# EAGLE design Uni-2,0,Complete (EAGLE 9.6.2)

## Sheet 1 of 4
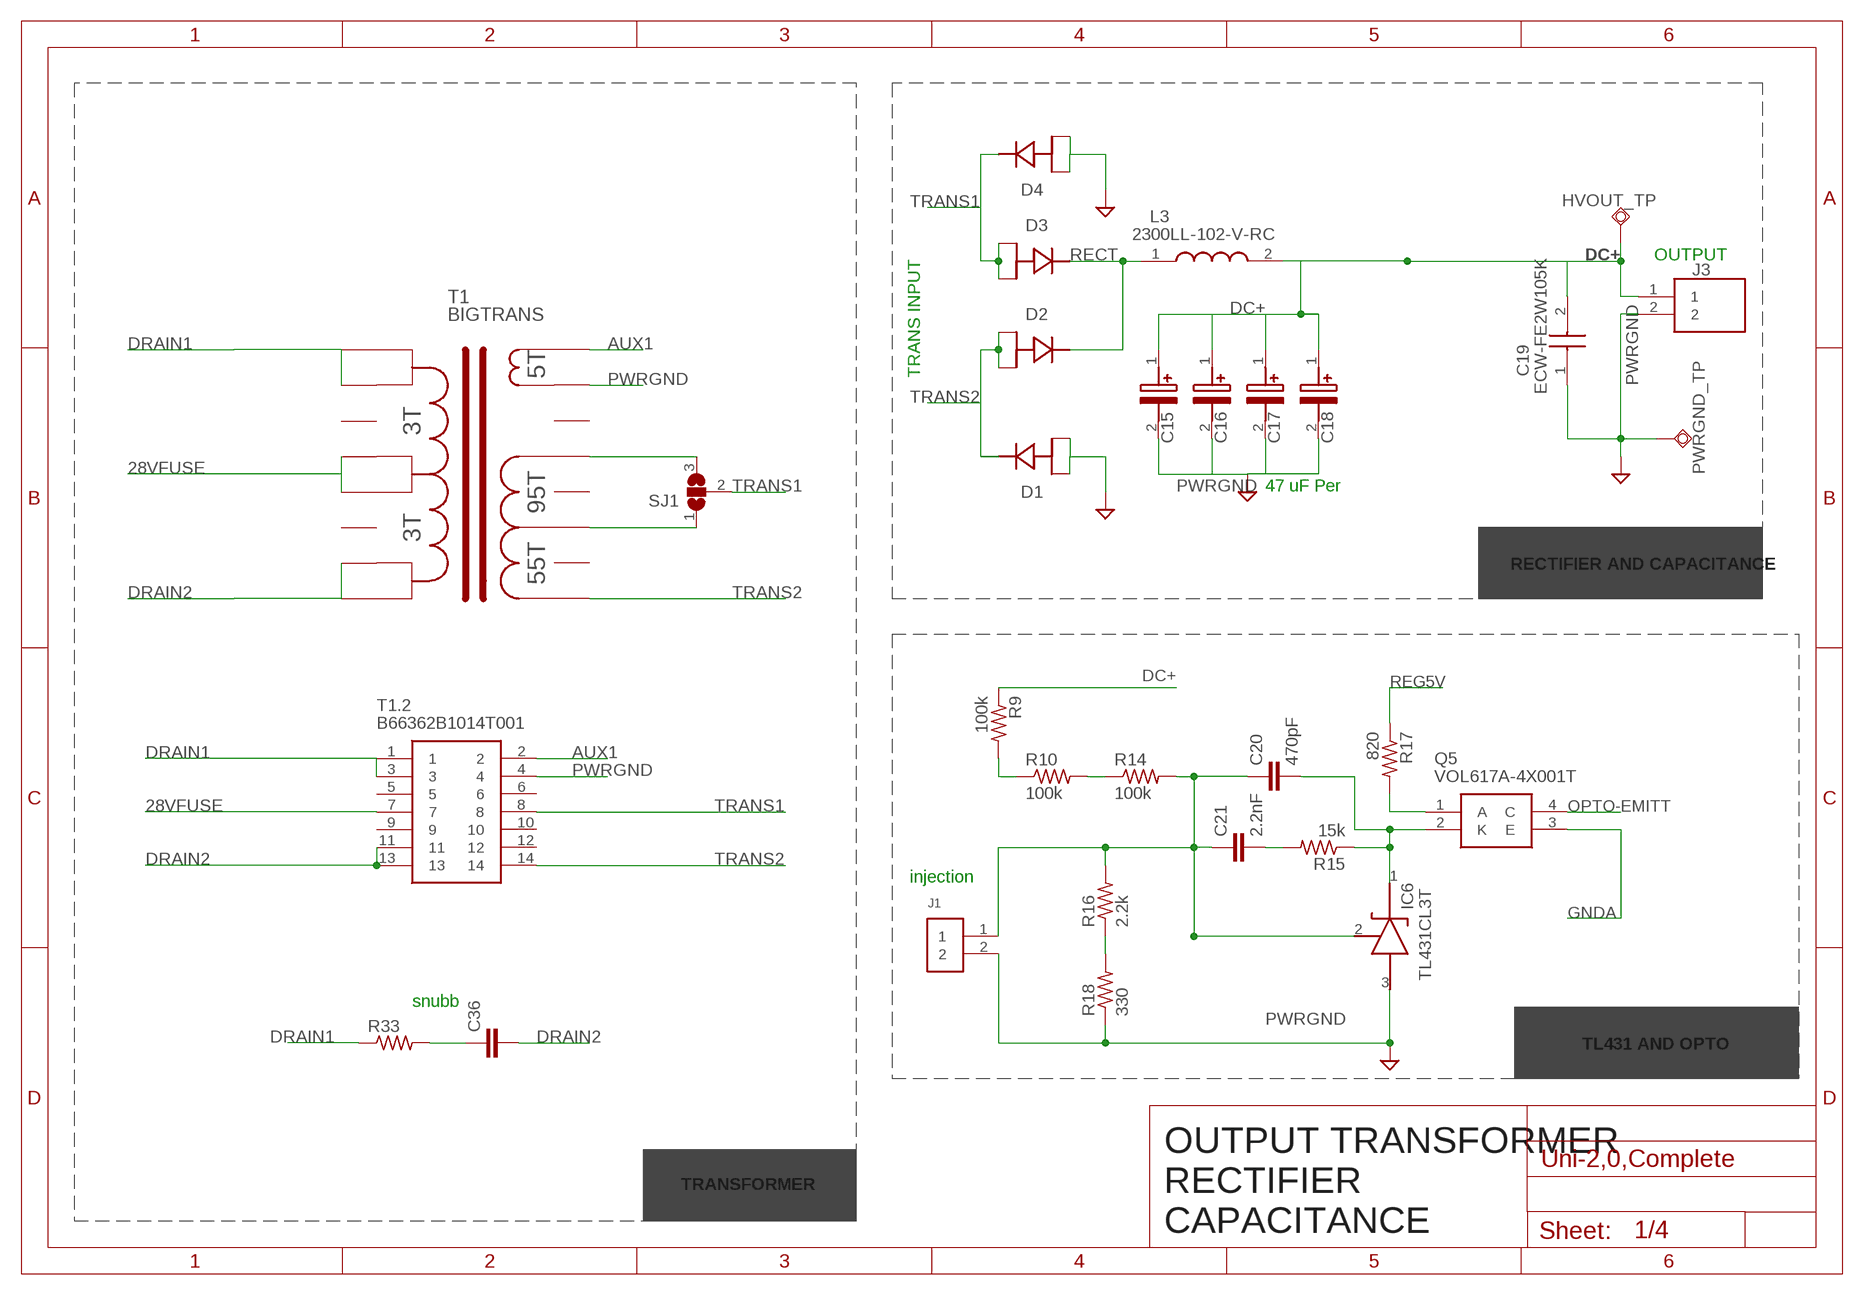
[diagram p0: schematic, sheet 1]

### Parts
C15  EEU-ED2V470S  [CAPPRD750W85D1800H2200]
C16  EEU-ED2V470S  [CAPPRD750W85D1800H2200]
C17  EEU-ED2V470S  [CAPPRD750W85D1800H2200]
C18  EEU-ED2V470S  [CAPPRD750W85D1800H2200]
C19  ECW-FE2W105K  [ECWFE2W105K]
C20  470pF  C-EUC0603K  [C0603K]
C21  2.2nF  C-EUC0603K  [C0603K]
C36  C-EUC1210K  [C1210K]
D1  FERD20H60CG-TR  [STB20N95K5]
D2  FERD20H60CG-TR  [STB20N95K5]
D3  FERD20H60CG-TR  [STB20N95K5]
D4  FERD20H60CG-TR  [STB20N95K5]
HVOUT_TP  TPSQPAD1-13  [P1-13]
IC6  TL431CL3T  [SOT95P237X112-3N]
J1  61300211121  [61300211121]
J3  2305908-2  [23059082]
L3  2300LL-102-V-RC  [2300LL102VRC]
PWRGND_TP  TPSQPAD1-13  [P1-13]
Q5  VOL617A-4X001T  [SOP254P1015X230-4N]
R9  100k  R-US_R1206  [R1206]
R10  100k  R-US_R1206  [R1206]
R14  100k  R-US_R1206  [R1206]
R15  15k  R-US_R0603  [R0603]
R16  2.2k  R-US_R0805  [R0805]
R17  820  R-US_R0603  [R0603]
R18  330  R-US_R0805  [R0805]
R33  R-US_R1206  [R1206]
SJ1  SJ2WW  [SJ_2W]
T1  BIGTRANS  [BIGTRANS!]
T1.2  B66362B1014T001  [B66362B1014T001]

### Nets
28VFUSE: T1.2.7 T1.4 T1.5 ; also sheet 3,4
AUX1: T1.2.2 T1.16 ; also sheet 3
DC+: C15.1(+) C16.1(+) C17.1(+) C18.1(+) C19.2 HVOUT_TP.TP J3.1 L3.2 R9.1 ; also sheet 2
DRAIN1: R33.1 T1.2.1 T1.2.3 T1.7 T1.8 ; also sheet 4
DRAIN2: C36.2 T1.1 T1.2 T1.2.11 T1.2.13 ; also sheet 4
GNDA: Q5.3(E) ; also sheet 3,4
N$1: R9.2 R10.1
N$3: C20.1 C21.1 IC6.2(REF) J1.1 R14.2 R16.2
N$9: SJ1.1 T1.11
N$15: R10.2 R14.1
N$16: R16.1 R18.2
N$18: C20.2 IC6.1(CATHODE) Q5.2(K) R15.1
N$19: Q5.1(A) R17.2
N$21: C21.2 R15.2
N$25: SJ1.3 T1.13
N$29: C36.1 R33.2
OPTO-EMITT: Q5.4(C) ; also sheet 4
PWRGND: C15.2(-) C16.2(-) C17.2(-) C18.2(-) C19.1 D1.1(A1) D1.3(A2) D4.1(A1) D4.3(A2) IC6.3(ANODE) J1.2 J3.2 PWRGND_TP.TP R18.1 T1.2.4 T1.15 ; supply symbol labelled GND ; also sheet 2,3
RECT: D2.2(K) D3.2(K) L3.1
REG5V: R17.1 ; also sheet 2,3
TRANS1: D3.1(A1) D3.3(A2) D4.2(K) SJ1.2 T1.2.8
TRANS2: D1.2(K) D2.1(A1) D2.3(A2) T1.2.14 T1.9
Unconnected: T1.2.5 T1.2.6 T1.2.9 T1.2.10 T1.2.12 T1.3 T1.6 T1.10 T1.12 T1.14

### Notes on the sheet
- TRANS INPUT | OUTPUT
- 47 uF Per
- RECTIFIER AND CAPACITANCE
- injection
- snubb
- TL431 AND OPTO
- TRANSFORMER
- OUTPUT TRANSFORMER
  RECTIFIER
  CAPACITANCE

## Sheet 2 of 4
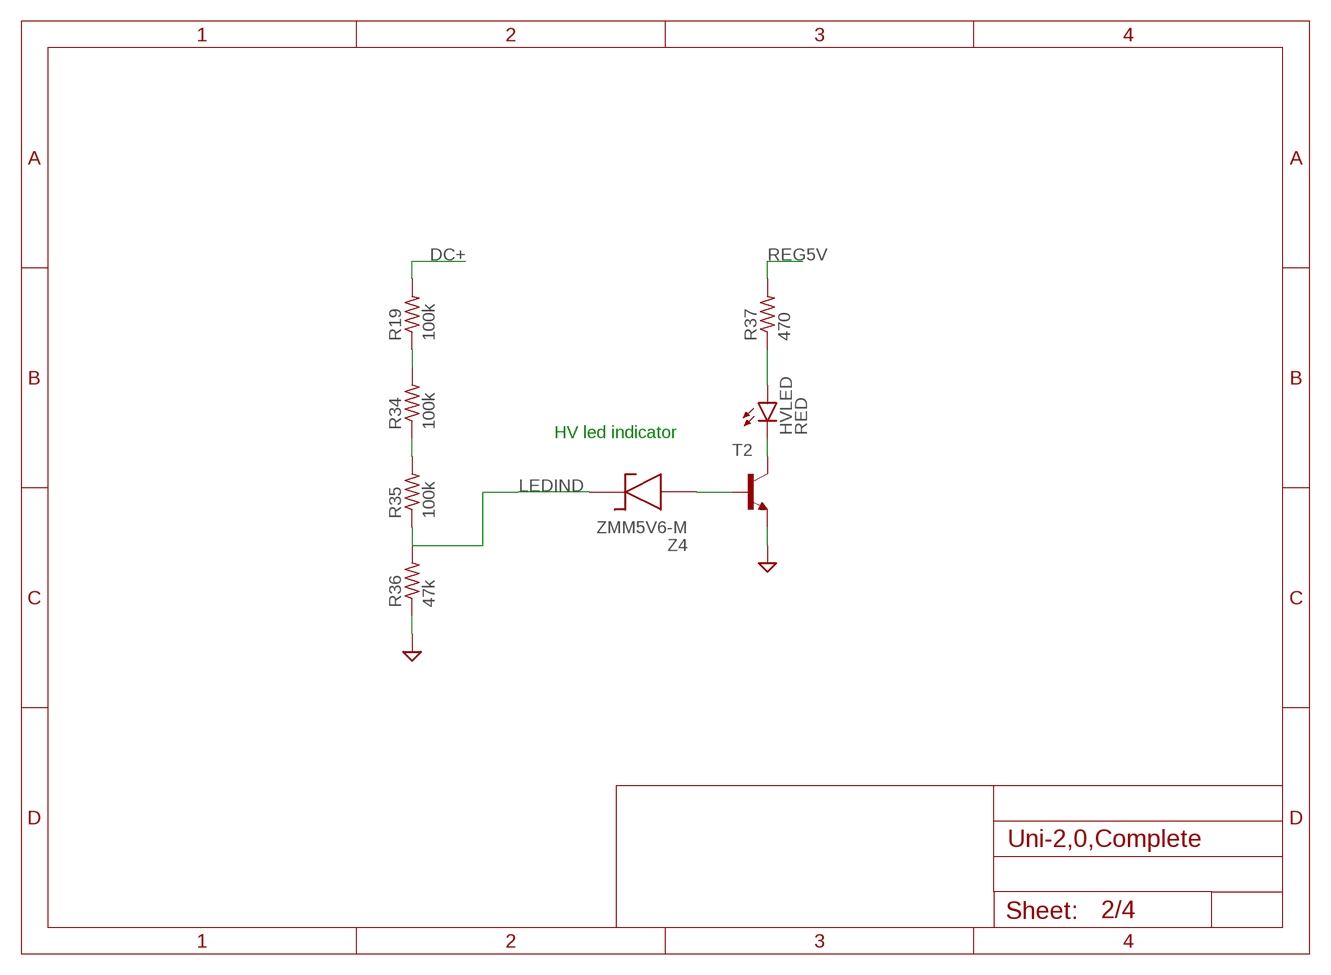
[diagram p1: schematic, sheet 2]

### Parts
HVLED  RED  LEDCHIPLED_0805  [CHIPLED_0805]
R19  100k  R-US_R1206  [R1206]
R34  100k  R-US_R1206  [R1206]
R35  100k  R-US_R1206  [R1206]
R36  47k  R-US_R0805  [R0805]
R37  470  R-US_R0603  [R0603]
T2  MMBT3904LT1-NPN-SOT23-BEC  [SOT23-BEC]
Z4  ZMM5V6-M  BZV55C5V6_L1  [BZV55C5V6L1]

### Nets
DC+: R19.2 ; also sheet 1
LEDIND: R35.1 R36.2 Z4.2(K)
N$20: R34.1 R35.2
N$23: R19.1 R34.2
N$24: T2.B Z4.1(A)
N$31: HVLED.C T2.C
N$32: HVLED.A R37.1
PWRGND: R36.1 T2.E ; supply symbol labelled GND ; also sheet 1,3
REG5V: R37.2 ; also sheet 1,3

### Notes on the sheet
- HV led indicator

## Sheet 3 of 4
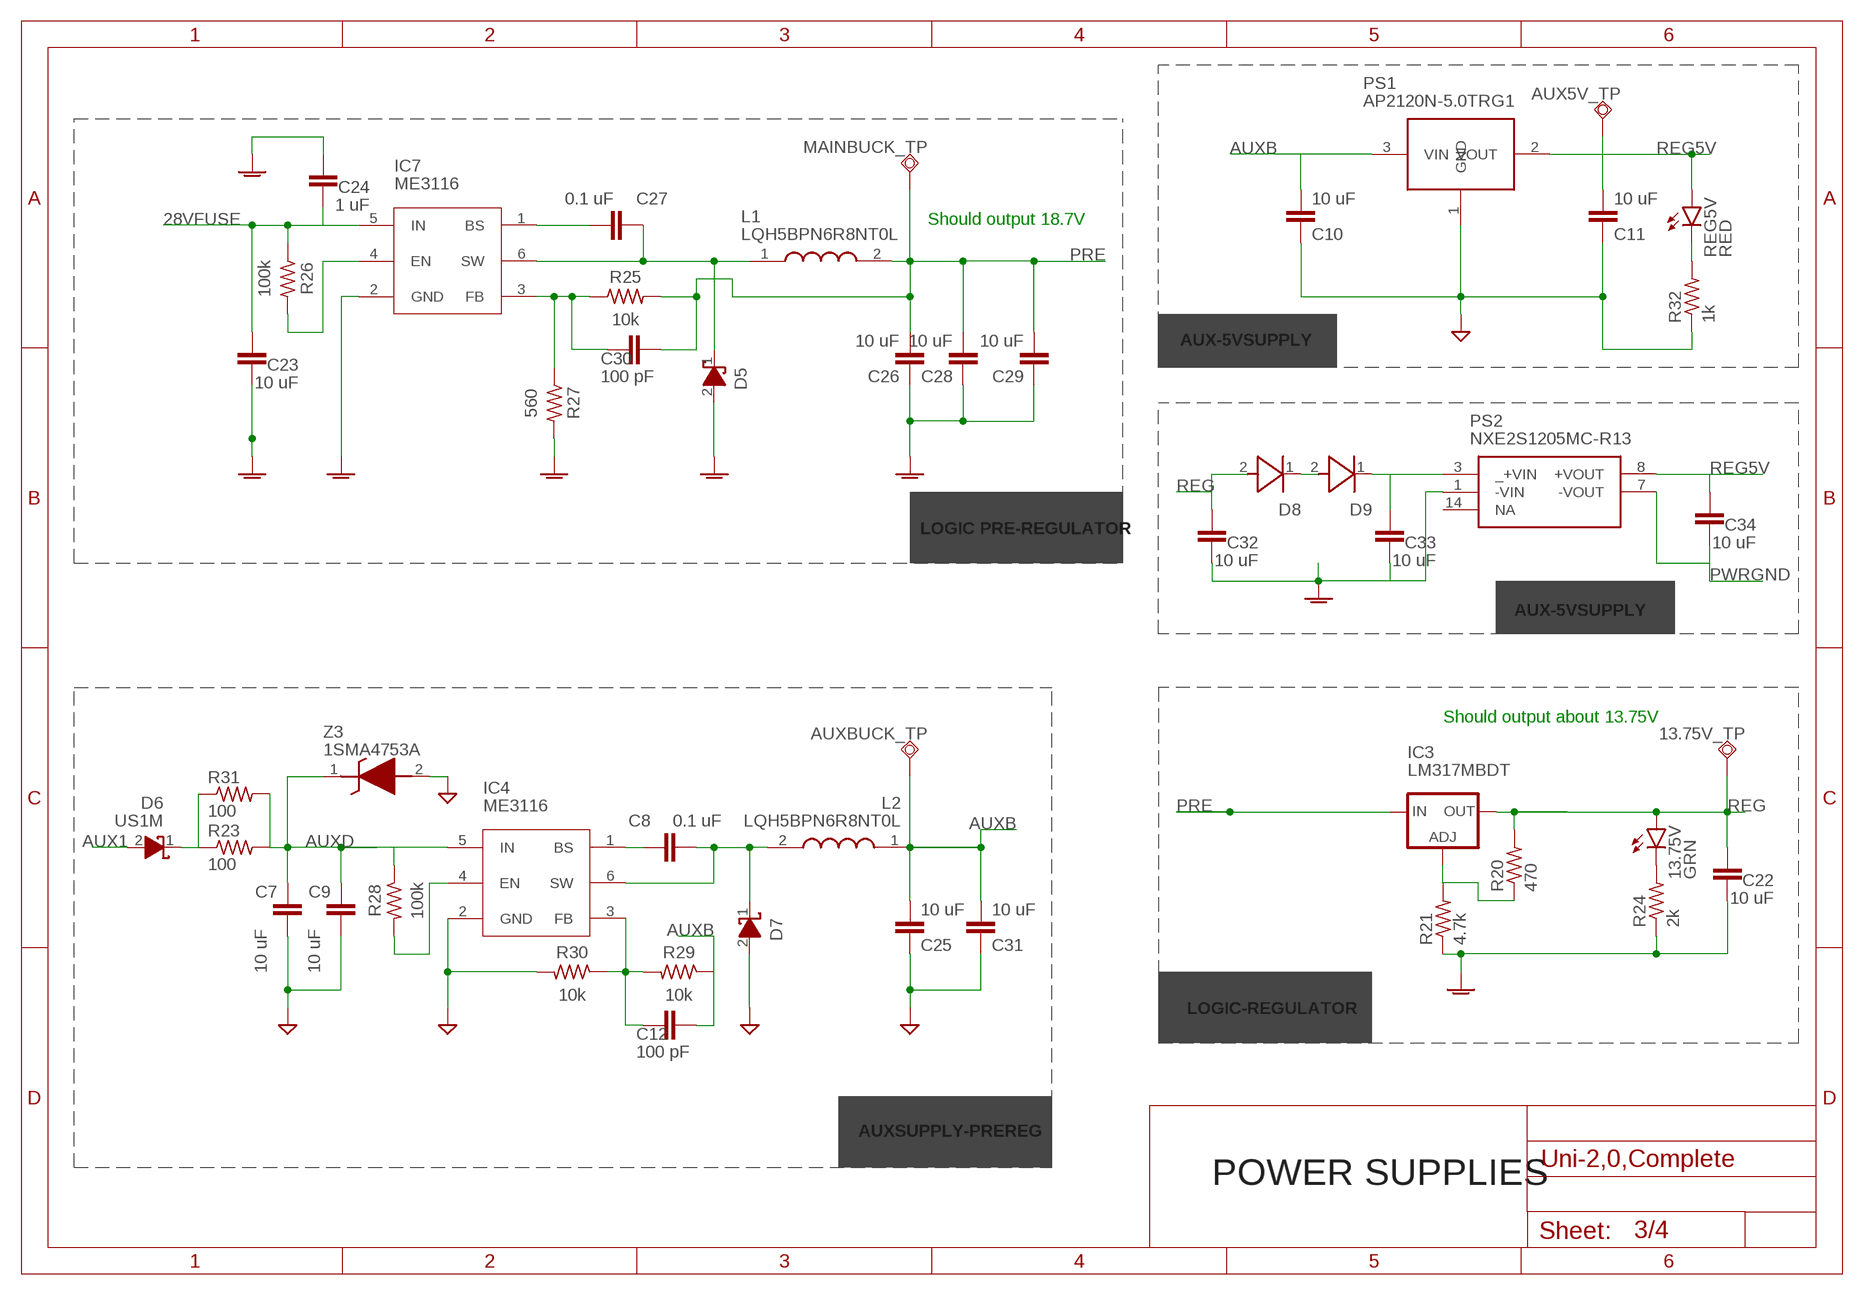
[diagram p2: schematic, sheet 3]

### Parts
13.75V  GRN  LEDCHIPLED_0805  [CHIPLED_0805]
13.75V_TP  TPSQPAD1-17  [P1-17]
AUX5V_TP  TPSQPAD1-17  [P1-17]
AUXBUCK_TP  TPSQPAD1-17  [P1-17]
C7  10 uF  C-EUC0805K  [C0805K]
C8  0.1 uF  C-EUC0603K  [C0603K]
C9  10 uF  C-EUC0805K  [C0805K]
C10  10 uF  C-EUC0603K  [C0603K]
C11  10 uF  C-EUC0603K  [C0603K]
C12  100 pF  C-EUC0402K  [C0402K]
C22  10 uF  C-EUC0805K  [C0805K]
C23  10 uF  C-EUC0805K  [C0805K]
C24  1 uF  C-EUC0603K  [C0603K]
C25  10 uF  C-EUC0603K  [C0603K]
C26  10 uF  C-EUC0805K  [C0805K]
C27  0.1 uF  C-EUC0603K  [C0603K]
C28  10 uF  C-EUC0805K  [C0805K]
C29  10 uF  C-EUC0805K  [C0805K]
C30  100 pF  C-EUC0402K  [C0402K]
C31  10 uF  C-EUC0402  [C0402]
C32  10 uF  C-EUC0805K  [C0805K]
C33  10 uF  C-EUC0603K  [C0603K]
C34  10 uF  C-EUC0603K  [C0603K]
D5  SCHOTTKY  [DIOM5127X229N]
D6  US1M  SCHOTTKY  [DIOM5127X229N]
D7  SCHOTTKY  [DIOM5127X229N]
D8  SM4007PL  1N4148W-7-F  [SOD3716X145N]
D9  SM4007PL  1N4148W-7-F  [SOD3716X145N]
IC3  LM317MBDT  [DPACK]
IC4  ME3116  [SOT95P280X100-6N]
IC7  ME3116  [SOT95P280X100-6N]
L1  LQH5BPN6R8NT0L  [LQH5BPB100MT0L]
L2  LQH5BPN6R8NT0L  [LQH5BPB100MT0L]
MAINBUCK_TP  TPSQPAD1-17  [P1-17]
PS1  AP2120N-5.0TRG1  [SOT95P240X120-3N]
PS2  NXE2S1205MC-R13  [NXE2S1205MCR13]
R20  470  R-US_R0603  [R0603]
R21  4.7k  R-US_R0603  [R0603]
R23  100  R-US_R1206  [R1206]
R24  2k  R-US_R0603  [R0603]
R25  10k  R-US_R0402  [R0402]
R26  100k  R-US_R0402  [R0402]
R27  560  R-US_R0402  [R0402]
R28  100k  R-US_R0402  [R0402]
R29  10k  R-US_R0402  [R0402]
R30  10k  R-US_R0402  [R0402]
R31  100  R-US_R1206  [R1206]
R32  1k  R-US_R0603  [R0603]
REG5V  RED  LEDCHIPLED_0805  [CHIPLED_0805]
Z3  1SMA4753A  1SMA5942BT3G  [DIOM5226X220N]

### Nets
28VFUSE: C23.2 C24.1 IC7.5(IN) R26.1 ; also sheet 1,4
AUX1: D6.2(A) ; also sheet 1
AUXB: AUXBUCK_TP.TP C10.2 C12.1 C25.2 C31.2 L2.1 PS1.3(VIN) R29.1
AUXD: C7.1 C9.1 IC4.5(IN) R23.2 R28.1 R31.2 Z3.1(K)
BS1: C27.2 IC7.1(BS)
BS2: C8.1 IC4.1(BS)
EN1: IC7.4(EN) R26.2
EN2: IC4.4(EN) R28.2
FB1: C30.2 IC7.3(FB) R25.1 R27.1
FB2: C12.2 IC4.3(FB) R29.2 R30.1
GNDA: C22.1 C23.1 C24.2 C26.1 C28.1 C29.1 C32.1 C33.1 D5.2(A) IC7.2(GND) PS2.1(-VIN) R21.1 R24.1 R27.2 ; also sheet 1,4
N$4: D8.1(K) D9.2(A)
N$10: IC3.1(ADJ) R20.1 R21.2
N$11: C33.2 D9.1(K) PS2.3(_+VIN)
N$22: 13.75V.C R24.2
N$26: R32.2 REG5V.C
N$27: D6.1(K) R23.1 R31.1
PRE: C26.2 C28.2 C29.2 C30.1 IC3.3(IN) L1.2 MAINBUCK_TP.TP R25.2
PWRGND: C7.2 C9.2 C10.1 C11.1 C25.1 C31.1 C34.1 D7.2(A) IC4.2(GND) PS1.1(GND) PS2.7(-VOUT) R30.2 R32.1 Z3.2(A) ; supply symbol labelled GND ; also sheet 1,2
REG: 13.75V.A 13.75V_TP.TP C22.2 C32.2 D8.2(A) IC3.4(OUT) R20.2 ; also sheet 4
REG5V: AUX5V_TP.TP C11.2 C34.2 PS1.2(VOUT) PS2.8(+VOUT) REG5V.A ; also sheet 1,2
SWITCH1: C27.1 D5.1(K) IC7.6(SW) L1.1
SWITCH2: C8.2 D7.1(K) IC4.6(SW) L2.2
Unconnected: PS2.14(NA)

### Notes on the sheet
- Should output 18.7V
- AUX-5VSUPPLY
- LOGIC PRE-REGULATOR
- AUX-5VSUPPLY
- Should output about 13.75V
- LOGIC-REGULATOR
- AUXSUPPLY-PREREG
- POWER SUPPLIES

## Sheet 4 of 4
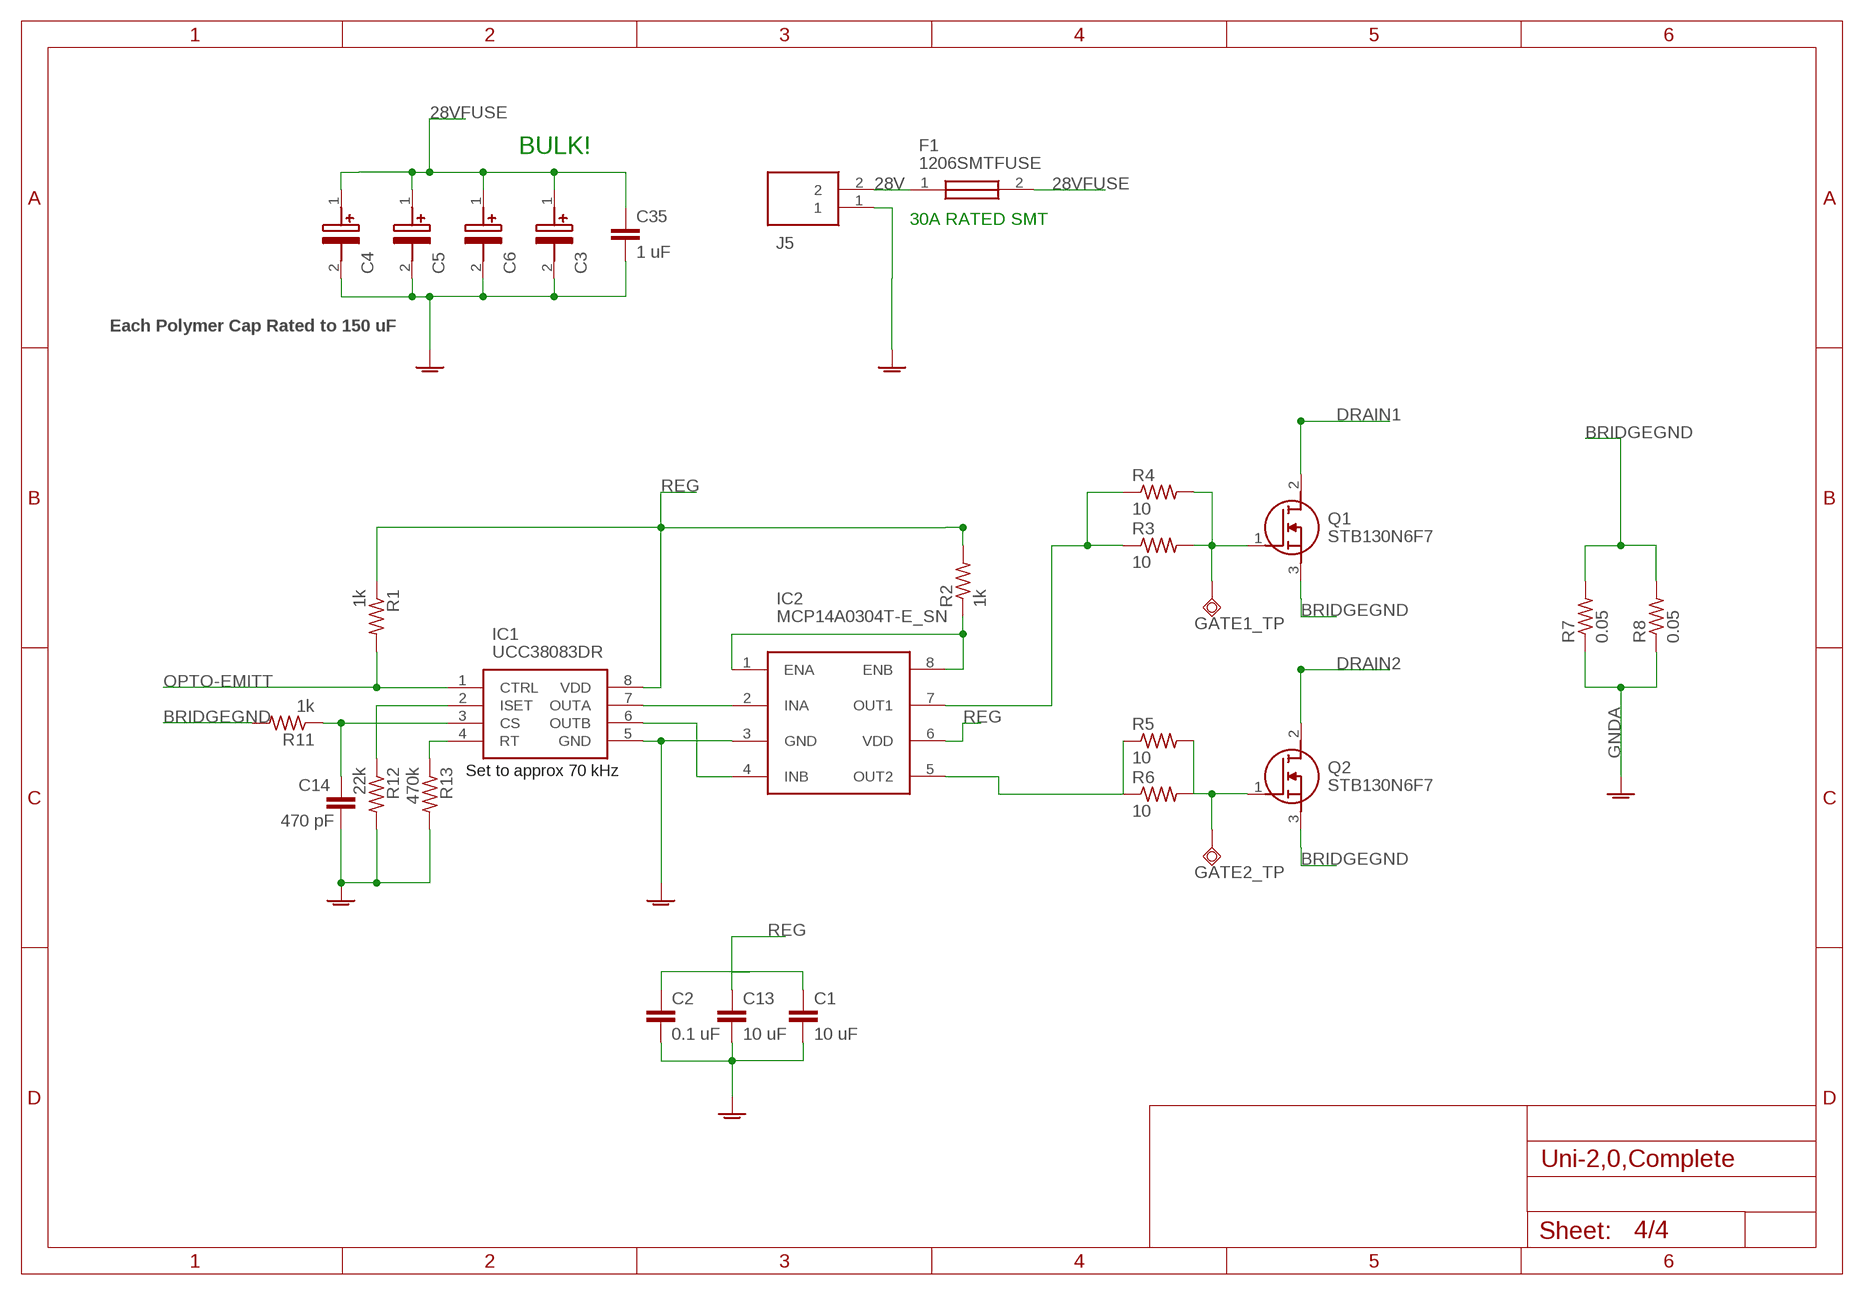
[diagram p3: schematic, sheet 4]

### Parts
C1  10 uF  C-EUC0603K  [C0603K]
C2  0.1 uF  C-EUC0603K  [C0603K]
C3  OVK151M1VTR-10131  [16SVF1000M]
C4  OVK151M1VTR-10131  [16SVF1000M]
C5  OVK151M1VTR-10131  [16SVF1000M]
C6  OVK151M1VTR-10131  [16SVF1000M]
C13  10 uF  C-EUC0603K  [C0603K]
C14  470 pF  C-EUC0603K  [C0603K]
C35  1 uF  C-EUC0805K  [C0805K]
F1  1206SMTFUSE  [1206SMTFUSE]
GATE1_TP  TPSQPAD1-17  [P1-17]
GATE2_TP  TPSQPAD1-17  [P1-17]
IC1  UCC38083DR  [SOIC127P600X175-8N]
IC2  MCP14A0304T-E_SN  [SOIC127P600X175-8N]
J5  2305908-2  [23059082]
Q1  STB130N6F7  [D2PAK]
Q2  STB130N6F7  [D2PAK]
R1  1k  R-US_R0603  [R0603]
R2  1k  R-US_R0402  [R0402]
R3  10  R-US_R0805  [R0805]
R4  10  R-US_R0805  [R0805]
R5  10  R-US_R0805  [R0805]
R6  10  R-US_R0805  [R0805]
R7  0.05  R-US_R2512  [R2512]
R8  0.05  R-US_R2512  [R2512]
R11  1k  R-US_R0603  [R0603]
R12  22k  R-US_R0603  [R0603]
R13  470k  R-US_R0603  [R0603]

### Nets
28V: F1.1 J5.2
28VFUSE: C3.1(+) C4.1(+) C5.1(+) C6.1(+) C35.1 F1.2 ; also sheet 1,3
BRIDGEGND: Q1.3(S) Q2.3(S) R7.2 R8.2 R11.2
CS-IN: C14.1 IC1.3(CS) R11.1
DRAIN1: Q1.2(D) ; also sheet 1
DRAIN2: Q2.2(D) ; also sheet 1
GNDA: C1.2 C2.2 C3.2(-) C4.2(-) C5.2(-) C6.2(-) C13.2 C14.2 C35.2 IC1.5(GND) IC2.3(GND) J5.1 R7.1 R8.1 R12.2 R13.2 ; also sheet 1,3
N$2: IC1.7(OUTA) IC2.2(INA)
N$5: IC1.6(OUTB) IC2.4(INB)
N$6: IC2.1(ENA) IC2.8(ENB) R2.1
N$7: IC2.7(OUT1) R3.1 R4.1
N$8: IC2.5(OUT2) R5.1 R6.1
N$13: IC1.2(ISET) R12.1
OPTO-EMITT: IC1.1(CTRL) R1.2 ; also sheet 1
Q1G: GATE1_TP.TP Q1.1(G) R3.2 R4.2
Q2G: GATE2_TP.TP Q2.1(G) R5.2 R6.2
REG: C1.1 C2.1 C13.1 IC1.8(VDD) IC2.6(VDD) R1.1 R2.2 ; also sheet 3
RT: IC1.4(RT) R13.1

### Notes on the sheet
- BULK!
- 30A RATED SMT
- Each Polymer Cap Rated to 150 uF
- Set to approx 70 kHz

## Library data of the parts
13.75V REG5V = led:LED: LED OSRAM: - CHIPLED LG R971, LG N971, LY N971, LG Q971, LY Q971, LO R971, LY R971 LH N974, LH R974 LS Q976, LO Q976, LY Q976 LO Q996 - Hyper CHIPLED LW Q18S LB Q993, LB Q99A, LB R99A - SideLED LS A670, LO A670, LY A670, LG A670, LP A670 LB A673, LV A673, LT A673, LW A673 LH A674 LY A675 LS A676, LA A676, LO A676, LY A676, LW A676 LS A679, LY A679, LG A679 - Hyper Micro SIDELED® LS Y876, LA Y876, LO Y876, LY Y876 LT Y87S - SmartLED LW L88C, LW L88S LB L89C, LB L89S, LG L890 LS L89K, LO L89K, LY L89K LS L896, LA L896, LO L896, LY L896 - TOPLED LS T670, LO T670, LY T670, LG T670, LP T670 LSG T670, LSP T670, LSY T670, LOP T670, LYG T670 LG T671, LOG T671, LSG T671 LB T673, LV T673, LT T673, LW T673 LH T674 LS T676, LA T676, LO T676, LY T676, LB T676, LH T676, LSB T676, LW T676 LB T67C, LV T67C, LT T67C, LS T67K, LO T67K, LY T67K, LW E67C LS E67B, LA E67B, LO E67B, LY E67B, LB E67C, LV E67C, LT E67C LW T67C LS T679, LY T679, LG T679 LS T770, LO T770, LY T770, LG T770, LP T770 LB T773, LV T773, LT T773, LW T773 LH T774 LS E675, LA E675, LY E675, LS T675 LS T776, LA T776, LO T776, LY T776, LB T776 LHGB T686 LT T68C, LB T68C - Hyper Mini TOPLED® LB M676 - Mini TOPLED Santana® LG M470 LS M47K, LO M47K, LY M47K Source: http://www.osram.convergy.de LUXEON: - LUMILED® LXK2-PW12-R00, LXK2-PW12-S00, LXK2-PW14-U00, LXK2-PW14-V00 LXK2-PM12-R00, LXK2-PM12-S00, LXK2-PM14-U00 LXK2-PE12-Q00, LXK2-PE12-R00, LXK2-PE12-S00, LXK2-PE14-T00, LXK2-PE14-U00 LXK2-PB12-K00, LXK2-PB12-L00, LXK2-PB12-M00, LXK2-PB14-N00, LXK2-PB14-P00, LXK2-PB14-Q00 LXK2-PR12-L00, LXK2-PR12-M00, LXK2-PR14-Q00, LXK2-PR14-R00 LXK2-PD12-Q00, LXK2-PD12-R00, LXK2-PD12-S00 LXK2-PH12-R00, LXK2-PH12-S00 LXK2-PL12-P00, LXK2-PL12-Q00, LXK2-PL12-R00 Source: www.luxeon.com KINGBRIGHT: KA-3528ASYC Source: www.kingbright.com; LCSC_PART: C72043
13.75V_TP AUX5V_TP AUXBUCK_TP GATE1_TP GATE2_TP HVOUT_TP MAINBUCK_TP PWRGND_TP = testpad:TPSQ: Test pad
C1 C2 C10 C13 C24 C25 C31 C33-C35 = rcl:C-EU: CAPACITOR, European symbol; LCSC_PART: C440198; SPICEPREFIX: C
C3-C6 = SamacSys_Parts:OVK151M1VTR-1013: OVK151M1VTR-1013
C7 C9 C11 C20 C21 C36 = rcl:C-EU: CAPACITOR, European symbol; SPICEPREFIX: C
C8 C27 = rcl:C-EU: CAPACITOR, European symbol; LCSC_PART: C14663; SPICEPREFIX: C
C12 C30 = rcl:C-EU: CAPACITOR, European symbol; LCSC_PART: C1546; SPICEPREFIX: C
C14 = rcl:C-EU: CAPACITOR, European symbol; LCSC_PART: C1620; SPICEPREFIX: C
C15-C18 = SamacSys_Parts:EEU-ED2V470S: Aluminium Electrolytic Capacitor, Radial Lead Source: Datasheet <http://industrial.panasonic.com/cdbs/www-data/pdf/RDF0000/ABA0000C1258.pdf>; DESCRIPTION: Aluminium Electrolytic Capacitor, Radial Lead; HEIGHT: 22mm; MANUFACTURER_NAME: Panasonic; MANUFACTURER_PART_NUMBER: EEU-ED2V470S; MOUSER_PART_NUMBER: 667-EEU-ED2V470S; MOUSER_PRICE-STOCK: https://www.mouser.co.uk/ProductDetail/Panasonic/EEU-ED2V470S?qs=MtOUKumLmnbbtLZIfgoN%2Fg%3D%3D
C19 = SamacSys_Parts:ECW-FE2W105K: Film Capacitors 450VDC 1.0uF 10% MPP L/S=15mm Source: Datasheet <https://www.mouser.fr/datasheet/2/315/panasonic_06262019_Capacitor_Film_Leaded_(ECW-F(E)-1609057.pdf>; DESCRIPTION: Film Capacitors 450VDC 1.0uF 10% MPP L/S=15mm; HEIGHT: 13mm; MANUFACTURER_NAME: Panasonic; MANUFACTURER_PART_NUMBER: ECW-FE2W105K
C22 C23 C26 C28 C29 C32 = rcl:C-EU: CAPACITOR, European symbol; LCSC_PART: C440198
D1-D4 = SamacSys_Parts:FERD20H60CG-TR: Rectifiers Field-Effect Rectifier Diode 60V Source: Datasheet <https://www.st.com/resource/en/datasheet/ferd20h60c.pdf>; DESCRIPTION: Rectifiers Field-Effect Rectifier Diode 60V; HEIGHT: 4mm; MANUFACTURER_NAME: STMicroelectronics; MANUFACTURER_PART_NUMBER: FERD20H60CG-TR; MOUSER_PART_NUMBER: 511-FERD20H60CG-TR; MOUSER_PRICE-STOCK: https://www.mouser.co.uk/ProductDetail/STMicroelectronics/FERD20H60CG-TR?qs=1mbolxNpo8ebHpKodyoUCQ%3D%3D
D5 D7 = SamacSys_Parts:SCHOTTKY: Schottky Diodes & Rectifiers 60V Sctky Bar Rectfr SMA (DO-214AC) Source: Datasheet <https://www.arrow.com/en/products/ss16he3-bh/vishay>; DESCRIPTION: Schottky Diodes & Rectifiers 60V Sctky Bar Rectfr SMA (DO-214AC); HEIGHT: 2.29mm; LCSC_PART: C22452; MANUFACTURER_NAME: Vishay; MANUFACTURER_PART_NUMBER: SS16HE3_B/H; MOUSER_PART_NUMBER: 78-SS16HE3_B/H; MOUSER_PRICE-STOCK: https://www.mouser.co.uk/ProductDetail/Vishay-General-Semiconductor/SS16HE3_B-H?qs=MLItCLRbWsyJmaJ87KUvIw%3D%3D
D6 = SamacSys_Parts:SCHOTTKY: Schottky Diodes & Rectifiers 60V Sctky Bar Rectfr SMA (DO-214AC) Source: Datasheet <https://www.arrow.com/en/products/ss16he3-bh/vishay>; DESCRIPTION: Schottky Diodes & Rectifiers 60V Sctky Bar Rectfr SMA (DO-214AC); HEIGHT: 2.29mm; MANUFACTURER_NAME: Vishay; MANUFACTURER_PART_NUMBER: SS16HE3_B/H; MOUSER_PART_NUMBER: 78-SS16HE3_B/H; MOUSER_PRICE-STOCK: https://www.mouser.co.uk/ProductDetail/Vishay-General-Semiconductor/SS16HE3_B-H?qs=MLItCLRbWsyJmaJ87KUvIw%3D%3D
D8 D9 = SamacSys_Parts:1N4148W-7-F: Diode Switching 150mA 100V 400mW SOD123 Diodes Inc 1N4148W-7-F Switching Diode 100V, 2-Pin SOD-123 Source: Datasheet <https://componentsearchengine.com/Datasheets/2/1N4148W-7-F.pdf>; DESCRIPTION: Diode Switching 150mA 100V 400mW SOD123 Diodes Inc 1N4148W-7-F Switching Diode 100V, 2-Pin SOD-123; HEIGHT: 1.45mm; LCSC_PART: C64898; MANUFACTURER_NAME: Diodes Inc.; MANUFACTURER_PART_NUMBER: 1N4148W-7-F; MOUSER_PART_NUMBER: 621-1N4148W-F; MOUSER_PRICE-STOCK: https://www.mouser.co.uk/ProductDetail/Diodes-Incorporated/1N4148W-7-F?qs=LHX0FizJzg7Ae9ZM8LTAWw%3D%3D
F1 = SamacSys_Parts:1206SMTFUSE: Surface Mount Fuses Surface Mt Chip fuse 1206 size, 40A Source: Datasheet <https://www.belfuse.com/resources/datasheets/circuitprotection/ds-cp-0685p-series.pdf>; DESCRIPTION: Surface Mount Fuses Surface Mt Chip fuse 1206 size, 40A; HEIGHT: 0.83mm; MANUFACTURER_NAME: Stewart Connector; MANUFACTURER_PART_NUMBER: 0685P9400-01; MOUSER_PART_NUMBER: 530-0685P9400-01; MOUSER_PRICE-STOCK: https://www.mouser.co.uk/ProductDetail/Bel-Fuse/0685P9400-01?qs=vLWxofP3U2w%252BWbEEn77VXg%3D%3D
HVLED = led:LED: LED OSRAM: - CHIPLED LG R971, LG N971, LY N971, LG Q971, LY Q971, LO R971, LY R971 LH N974, LH R974 LS Q976, LO Q976, LY Q976 LO Q996 - Hyper CHIPLED LW Q18S LB Q993, LB Q99A, LB R99A - SideLED LS A670, LO A670, LY A670, LG A670, LP A670 LB A673, LV A673, LT A673, LW A673 LH A674 LY A675 LS A676, LA A676, LO A676, LY A676, LW A676 LS A679, LY A679, LG A679 - Hyper Micro SIDELED® LS Y876, LA Y876, LO Y876, LY Y876 LT Y87S - SmartLED LW L88C, LW L88S LB L89C, LB L89S, LG L890 LS L89K, LO L89K, LY L89K LS L896, LA L896, LO L896, LY L896 - TOPLED LS T670, LO T670, LY T670, LG T670, LP T670 LSG T670, LSP T670, LSY T670, LOP T670, LYG T670 LG T671, LOG T671, LSG T671 LB T673, LV T673, LT T673, LW T673 LH T674 LS T676, LA T676, LO T676, LY T676, LB T676, LH T676, LSB T676, LW T676 LB T67C, LV T67C, LT T67C, LS T67K, LO T67K, LY T67K, LW E67C LS E67B, LA E67B, LO E67B, LY E67B, LB E67C, LV E67C, LT E67C LW T67C LS T679, LY T679, LG T679 LS T770, LO T770, LY T770, LG T770, LP T770 LB T773, LV T773, LT T773, LW T773 LH T774 LS E675, LA E675, LY E675, LS T675 LS T776, LA T776, LO T776, LY T776, LB T776 LHGB T686 LT T68C, LB T68C - Hyper Mini TOPLED® LB M676 - Mini TOPLED Santana® LG M470 LS M47K, LO M47K, LY M47K Source: http://www.osram.convergy.de LUXEON: - LUMILED® LXK2-PW12-R00, LXK2-PW12-S00, LXK2-PW14-U00, LXK2-PW14-V00 LXK2-PM12-R00, LXK2-PM12-S00, LXK2-PM14-U00 LXK2-PE12-Q00, LXK2-PE12-R00, LXK2-PE12-S00, LXK2-PE14-T00, LXK2-PE14-U00 LXK2-PB12-K00, LXK2-PB12-L00, LXK2-PB12-M00, LXK2-PB14-N00, LXK2-PB14-P00, LXK2-PB14-Q00 LXK2-PR12-L00, LXK2-PR12-M00, LXK2-PR14-Q00, LXK2-PR14-R00 LXK2-PD12-Q00, LXK2-PD12-R00, LXK2-PD12-S00 LXK2-PH12-R00, LXK2-PH12-S00 LXK2-PL12-P00, LXK2-PL12-Q00, LXK2-PL12-R00 Source: www.luxeon.com KINGBRIGHT: KA-3528ASYC Source: www.kingbright.com
IC1 = SamacSys_Parts:UCC38083DR: Current Mode Push-Pull PWM With Programmable Slope Compensation Source: Datasheet <http://www.ti.com/lit/gpn/ucc38083>; DESCRIPTION: Current Mode Push-Pull PWM With Programmable Slope Compensation; HEIGHT: 1.75mm; MANUFACTURER_NAME: Texas Instruments; MANUFACTURER_PART_NUMBER: UCC38083DR; MOUSER_PART_NUMBER: 595-UCC38083DR; MOUSER_PRICE-STOCK: https://www.mouser.co.uk/ProductDetail/Texas-Instruments/UCC38083DR/?qs=zqbRmZ%252BfZD9Rvt3ie7yhvg%3D%3D
IC2 = SamacSys_Parts:MCP14A0304T-E_SN: Microchip Technology MCP14A0304T-E/SN Dual Low Side MOSFET Power Driver, 3A 8-Pin, SOIC Source: Datasheet <http://www.microchip.com/mymicrochip/filehandler.aspx?ddocname=en606629>; DESCRIPTION: Microchip Technology MCP14A0304T-E/SN Dual Low Side MOSFET Power Driver, 3A 8-Pin, SOIC; HEIGHT: 1.75mm; MANUFACTURER_NAME: Microchip; MANUFACTURER_PART_NUMBER: MCP14A0304T-E/SN; MOUSER_PART_NUMBER: 579-MCP14A0304T-E/SN; MOUSER_PRICE-STOCK: https://www.mouser.co.uk/ProductDetail/Microchip-Technology/MCP14A0304T-E-SN?qs=w%2Fv1CP2dgqqqWUCaoFqV0w%3D%3D
IC3 = v-reg:LM317?*: 500 mA Adjustable Output Positive Voltage Regulator Source: http://www.onsemi.co.jp .. LM317M-D.PDF
IC4 IC7 = SamacSys_Parts:ME3116; LCSC_PART: C97643
IC6 = SamacSys_Parts:TL431CL3T: Adjustable micropower shunt voltage reference Source: Datasheet <https://www.st.com/resource/en/datasheet/tl431.pdf>; DESCRIPTION: Adjustable micropower shunt voltage reference; HEIGHT: 1.12mm; MANUFACTURER_NAME: STMicroelectronics; MANUFACTURER_PART_NUMBER: TL431CL3T; MOUSER_PART_NUMBER: 511-TL431CL3T; MOUSER_PRICE-STOCK: https://www.mouser.co.uk/ProductDetail/STMicroelectronics/TL431CL3T?qs=L6eUzyzWLAsU2SYO1NdhdA%3D%3D
J1 = Headers:61300211121: CONN HEADER VERT 2POS 2.54MM Manufacturer's datasheet <https://katalog.we-online.de/em/datasheet/6130xx11121.pdf>; CREATED_BY: PCBLayout.com; DIGI_KEY_PART_NUMBER: 732-5315-ND; MANUFACTURER: Wurth Electronics Inc.; MPN: 61300211121
J3 J5 = SamacSys_Parts:2305908-2: TE CONNECTIVITY / BUCHANAN - 2305908-2 - TERMINAL BLOCK, HEADER, 2POS, SMD Source: Datasheet <https://www.te.com/commerce/DocumentDelivery/DDEController?Action=srchrtrv&DocNm=1-1773930-3_BuchananWM_Brochure&DocType=Data Sheet&DocLang=English&PartCntxt=2305908-2&DocFormat=pdf>; DESCRIPTION: TE CONNECTIVITY / BUCHANAN - 2305908-2 - TERMINAL BLOCK, HEADER, 2POS, SMD; HEIGHT: 9mm; MANUFACTURER_NAME: TE Connectivity; MANUFACTURER_PART_NUMBER: 2305908-2; MOUSER_PART_NUMBER: 571-2305908-2; MOUSER_PRICE-STOCK: https://www.mouser.co.uk/ProductDetail/TE-Connectivity-Buchanan/2305908-2?qs=BZBei1rCqCB0kX75zk6ERQ%3D%3D
L1 L2 = SamacSys_Parts:LQH5BPN6R8NT0L: MURATA - LQH5BPN6R8NT0L - INDUCTOR, 6.8UH, +/-30%, POWER Source: Datasheet <https://psearch.en.murata.com/inductor/product/LQH5BPN6R8NT0#.html>; DESCRIPTION: MURATA - LQH5BPN6R8NT0L - INDUCTOR, 6.8UH, +/-30%, POWER; HEIGHT: 2.2mm; MANUFACTURER_NAME: Murata Electronics; MANUFACTURER_PART_NUMBER: LQH5BPN6R8NT0L; MOUSER_PART_NUMBER: 81-LQH5BPN6R8NT0L0L; MOUSER_PRICE-STOCK: https://www.mouser.co.uk/ProductDetail/Murata-Electronics/LQH5BPN6R8NT0L?qs=3ZwS9AhGA%2F4N8axqd87eRQ%3D%3D
L3 = SamacSys_Parts:2300LL-102-V-RC: Inductor High Current Toroid 1000uH/378.9uH 15% 1KHz 3.5A 137mOhm DCR RDL Source: Datasheet; DESCRIPTION: Inductor High Current Toroid 1000uH/378.9uH 15% 1KHz 3.5A 137mOhm DCR RDL; HEIGHT: 32.512mm; MANUFACTURER_NAME: Bourns; MANUFACTURER_PART_NUMBER: 2300LL-102-V-RC; MOUSER_PART_NUMBER: 652-2300LL-102-V-RC; MOUSER_PRICE-STOCK: https://www.mouser.co.uk/ProductDetail/Bourns/2300LL-102-V-RC?qs=d7g9p1yFhWZHzfawXthNnQ%3D%3D
PS1 = SamacSys_Parts:AP2120N-5.0TRG1: IC REG LINEAR 5V 150MA SOT23 Source: Datasheet; DESCRIPTION: IC REG LINEAR 5V 150MA SOT23; HEIGHT: 1.2mm; MANUFACTURER_NAME: Diodes Inc.; MANUFACTURER_PART_NUMBER: AP2120N-5.0TRG1; MOUSER_PART_NUMBER: 621-AP2120N-5.0TRG1; MOUSER_PRICE-STOCK: https://www.mouser.co.uk/ProductDetail/Diodes-Incorporated/AP2120N-50TRG1?qs=M%2FOdCRO8QQ3JQu49DdtyIA%3D%3D
PS2 = SamacSys_Parts:NXE2S1205MC-R13: Isolated DC/DC Converters DC/DC SM 2W 12-5V Single 3kV Source: Datasheet; DESCRIPTION: Isolated DC/DC Converters DC/DC SM 2W 12-5V Single 3kV; HEIGHT: 4.81mm; MANUFACTURER_NAME: Murata Electronics; MANUFACTURER_PART_NUMBER: NXE2S1205MC-R13; MOUSER_PART_NUMBER: 580-NXE2S1205MC-R13; MOUSER_PRICE-STOCK: https://www.mouser.co.uk/ProductDetail/Murata-Power-Solutions/NXE2S1205MC-R13?qs=UqPySVGgRwFuSegQbHt7Hw%3D%3D
Q1 Q2 = SamacSys_Parts:STB130N6F7
Q5 = SamacSys_Parts:VOL617A-4X001T: Vishay VOL617A-4X001T DC Input Phototransistor Output Optocoupler, Surface Mount, 4-Pin LSOP Source: Datasheet <https://www.vishay.com/docs/82424/vol617a.pdf>; DESCRIPTION: Vishay VOL617A-4X001T DC Input Phototransistor Output Optocoupler, Surface Mount, 4-Pin LSOP; HEIGHT: 2.3mm; MANUFACTURER_NAME: Vishay; MANUFACTURER_PART_NUMBER: VOL617A-4X001T; MOUSER_PART_NUMBER: 78-VOL617A-4X001T; MOUSER_PRICE-STOCK: https://www.mouser.co.uk/ProductDetail/Vishay-Semiconductors/VOL617A-4X001T?qs=s4XK1XdnRilEoTFGQUoymA%3D%3D
R1 R20 R21 R24 R32 = rcl:R-US_: RESISTOR, American symbol; LCSC_PART: C22975; SPICEPREFIX: R
R2-R10 R14-R19 R23 R31 R33-R37 = rcl:R-US_: RESISTOR, American symbol; SPICEPREFIX: R
R11 = rcl:R-US_: RESISTOR, American symbol; LCSC_PART: C21190; SPICEPREFIX: R
R12 = rcl:R-US_: RESISTOR, American symbol; LCSC_PART: C31850; SPICEPREFIX: R
R13 = rcl:R-US_: RESISTOR, American symbol; LCSC_PART: C25811; SPICEPREFIX: R
R25 R29 R30 = rcl:R-US_: RESISTOR, American symbol; LCSC_PART: C25779; SPICEPREFIX: R
R26 R28 = rcl:R-US_: RESISTOR, American symbol; LCSC_PART: C25741; SPICEPREFIX: R
R27 = rcl:R-US_: RESISTOR, American symbol; LCSC_PART: C4177; SPICEPREFIX: R
SJ1 = jumper:SJ2W: SMD solder JUMPER
T1 = SamacSys_Parts:BIGTRANS
T1.2 = SamacSys_Parts:B66362B1014T001: Ferrite Accessories, E Cores Accessories(EFD/ER/ETD), Coil former (ETD 34/17/11) Source: Datasheet <https://product.tdk.com/system/files/dam/doc/product/ferrite/ferrite/ferrite-acc/data_sheet/80/db/fer/etd_34_17_11.pdf>; DESCRIPTION: Ferrite Accessories, E Cores Accessories(EFD/ER/ETD), Coil former (ETD 34/17/11); HEIGHT: 33.1mm; MANUFACTURER_NAME: TDK; MANUFACTURER_PART_NUMBER: B66362B1014T001; MOUSER_PART_NUMBER: 871-B66362B1014T001; MOUSER_PRICE-STOCK: https://www.mouser.co.uk/ProductDetail/EPCOS-TDK/B66362B1014T001?qs=w5o0Loj0u7M9FVK%2Ff7P38g%3D%3D
T2 = transistor-neu-to92:*-NPN-: NPN Transistror
Z3 = SamacSys_Parts:1SMA5942BT3G: ON Semiconductor 1SMA5942BT3G Zener Diode, 51V 5% 1.5 W SMT 2-Pin SMA Source: Datasheet <http://www.onsemi.com/pub/Collateral/1SMA5913BT3-D.PDF>; DESCRIPTION: ON Semiconductor 1SMA5942BT3G Zener Diode, 51V 5% 1.5 W SMT 2-Pin SMA; HEIGHT: 2.2mm; LCSC_PART: C362284; MANUFACTURER_NAME: onsemi; MANUFACTURER_PART_NUMBER: 1SMA5942BT3G; MOUSER_PART_NUMBER: 863-1SMA5942BT3G; MOUSER_PRICE-STOCK: https://www.mouser.co.uk/ProductDetail/ON-Semiconductor/1SMA5942BT3G?qs=y2kkmE52mdPrQGqg%252Bfz9yg%3D%3D
Z4 = SamacSys_Parts:BZV55C5V6_L1: Taiwan Semi BZV55C5V6 L1 Zener Diode, 5.6V 5% 500 mW SMT 2-Pin MiniMELF Source: Datasheet; DESCRIPTION: Taiwan Semi BZV55C5V6 L1 Zener Diode, 5.6V 5% 500 mW SMT 2-Pin MiniMELF; HEIGHT: 1.6mm; MANUFACTURER_NAME: Taiwan Semiconductor; MANUFACTURER_PART_NUMBER: BZV55C5V6 L1; MOUSER_PART_NUMBER: 821-BZV55C5V6L1; MOUSER_PRICE-STOCK: https://www.mouser.co.uk/ProductDetail/Taiwan-Semiconductor/BZV55C5V6-L1?qs=SikLhao2tv9IOs7k0fPtEg%3D%3D

## Board
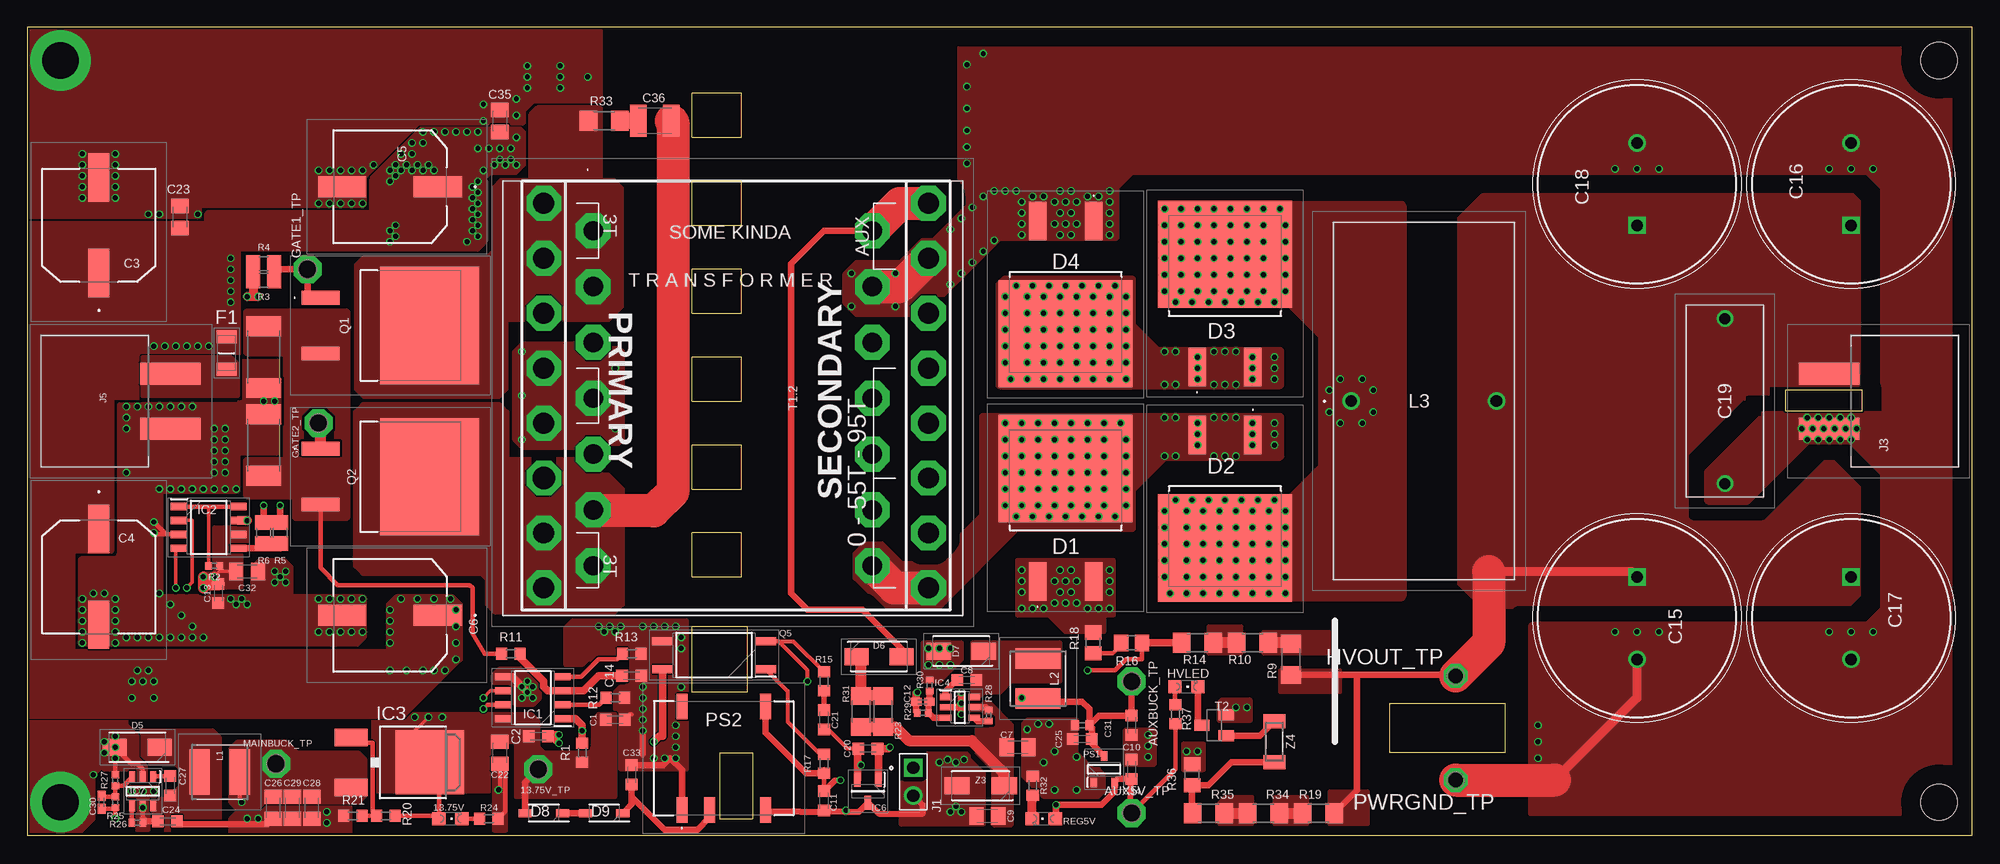
[diagram p4: board, top side]
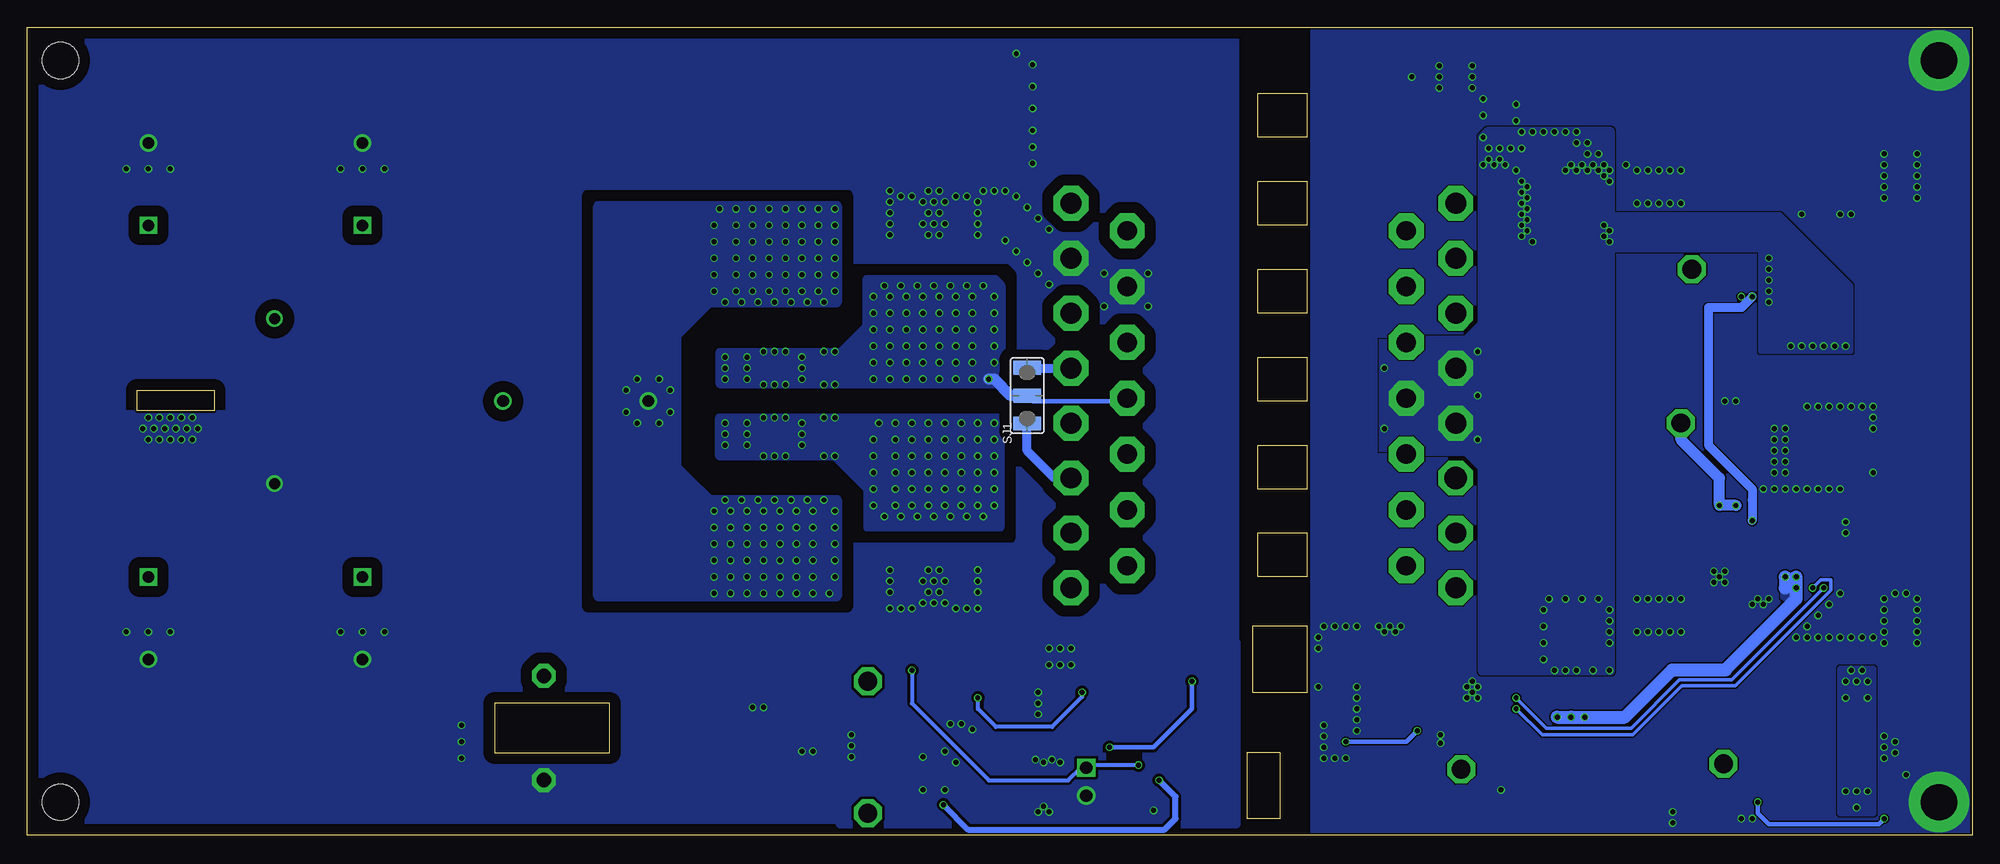
[diagram p5: board, bottom side, seen from below]

Size 177 x 73.5 mm. Coordinates in mm from the lower left corner, seen from the top.
Outline: 0,0 177,0 177,73.5 0,73.5 0,0
Outline: 60.5,13 60.5,19 65.5,19 65.5,13 60.5,13
Outline: 60.5,23.5 65,23.5 65,27.5 60.5,27.5 60.5,23.5
Outline: 60.5,31.5 65,31.5 65,35.5 60.5,35.5 60.5,31.5
Outline: 60.5,39.5 65,39.5 65,43.5 60.5,43.5 60.5,39.5
Outline: 60.5,47.5 65,47.5 65,51.5 60.5,51.5 60.5,47.5
Outline: 60.5,55.5 65,55.5 65,59.5 60.5,59.5 60.5,55.5
Outline: 60.5,63.5 65,63.5 65,67.5 60.5,67.5 60.5,63.5
Outline: 134.5,7.5 124,7.5 124,12 134.5,12 134.5,7.5
Outline: 166.5,40.5 160,40.5 160,38.62 167,38.62 167,40.5 166.5,40.5
Outline: 63,7.5 63,1.5 66,1.5 66,7.5 63,7.5
Copper layers (1*16): Top 0.035559375mm / dielectric 1.6mm / Bottom 0.035559375mm
Design rules "jlcpcb2layer *": minimum track width 5mil, minimum drill 12mil, track to track 5mil, track to pad 5mil, pad to pad 5mil, via to via 5mil, smd to smd 5mil, copper to edge 8mil, drill to drill 6mil, minimum pad ring 5mil, minimum via ring 3mil, stop-mask expansion 2.5mil, vias tented up to drill 30mil, thermal gap 10mil
Holes 3.3 mm at 174,70.5 174,3

### Footprints (pad centres in the part's own frame; a part is rotated, then mirrored left to right if it is on the bottom)
CHIPLED_0805 = smd 1.2 x 1.2: A 0,-1.05; C 0,1.05
P1-17 = drill 1.702 pad 2.54 octagon: TP 0,0
C0603K = smd 1.05 x 1.08: 1 -0.875,0; 2 0.875,0
16SVF1000M = smd 1.9 x 4.4: 1 0,-4.35; 2 0,4.35
C0805K = smd 1.3 x 1.6: 1 -1,0; 2 1,0
C0402K = smd 0.925 x 0.74: 1 -0.6,0; 2 0.6,0
CAPPRD750W85D1800H2200 = drill 1.05 pad 1.575 square: 1 0,0 | drill 1.05 pad 1.575: 2 7.5,0
ECWFE2W105K = drill 1 pad 1.5: 1 0,0; 2 15,0
C0402 = smd 0.7 x 0.9: 1 -0.65,0; 2 0.65,0
C1210K = smd 1.5 x 2.9: 1 -1.5,0; 2 1.5,0
STB20N95K5 = smd 1.6 x 3.5: 1 -2.54,-6.907; 3 2.54,-6.907 | smd 12.2 x 9.75: 2 0,3.368
DIOM5127X229N = smd 2.2 x 1.55: 1 -2.05,0; 2 2.05,0
SOD3716X145N = smd 1.2 x 0.75: 1 -1.7,0; 2 1.7,0
1206SMTFUSE = smd 1.17 x 1.8: 1 -1.47,0; 2 1.47,0
P1-13 = drill 1.321 pad 2.159 octagon: TP 0,0
SOIC127P600X175-8N = smd 1.5 x 0.65: 1 -2.7,1.905; 2 -2.7,0.635; 3 -2.7,-0.635; 4 -2.7,-1.905; 5 2.7,-1.905; 6 2.7,-0.635; 7 2.7,0.635; 8 2.7,1.905
DPACK = smd 1.6 x 3: 1 -2.28,-4.8; 3 2.28,-4.8 | smd 5.8 x 6.2: 4 0,2.38
SOT95P280X100-6N = smd 1.05 x 0.55: 1 -1.3,0.95; 2 -1.3,0; 3 -1.3,-0.95; 4 1.3,-0.95; 5 1.3,0; 6 1.3,0.95
SOT95P237X112-3N = smd 1.3 x 0.6: 1 -1.05,0.95; 2 -1.05,-0.95; 3 1.05,0
61300211121 = drill 1.1 square: 1 -1.27,0 | drill 1.1: 2 1.27,0
23059082 = smd 2 x 5.5: 1 -2.5,-4.5; 2 2.5,-4.5
LQH5BPB100MT0L = smd 1.85 x 4.1: 1 -1.825,0; 2 1.825,0
2300LL102VRC = drill 1.06 pad 1.59: 1 0,0; 2 13.208,0
SOT95P240X120-3N = smd 0.85 x 0.6: 1 -1.2,0.95; 2 -1.2,-0.95; 3 1.2,0
NXE2S1205MCR13 = smd 1 x 2.3: 1 -3.81,-4.7; 3 -1.27,-4.7; 7 3.81,-4.7; 8 3.81,4.7; 14 -3.81,4.7
D2PAK = smd 1.257 x 3.429: 1 -2.54,-8.192; 3 2.54,-8.192 | smd 10.668 x 9.017: 2 0,1.715
SOP254P1015X230-4N = smd 1.85 x 0.7: 1 -4.7,1.27; 2 -4.7,-1.27; 3 4.7,-1.27; 4 4.7,1.27
R0603 = smd 1 x 1.1: 1 -0.85,0; 2 0.85,0
R0402 = smd 0.6 x 0.7: 1 -0.5,0; 2 0.5,0
R0805 = smd 1.3 x 1.5: 1 -0.95,0; 2 0.95,0
R2512 = smd 1.8 x 3.2: 1 -2.8,0; 2 2.8,0
R1206 = smd 1.6 x 1.803: 1 -1.422,0; 2 1.422,0
SJ_2W = smd 1.27 x 2.54: 1 -2.54,0; 2 0,0; 3 2.54,0
BIGTRANS! = drill 1.905 pad 3.175 octagon: 1 0,0; 2 0,5; 4 0,15; 5 0,20; 6 0,25; 7 0,30; 8 0,35; 9 35,0; 10 35,5; 11 35,10; 12 35,15; 13 35,20; 14 35,25; 15 35,30; 16 35,35 | drill 2.032 pad 3.175 octagon: 3 0,10
B66362B1014T001 = drill 1.75 pad 3.175 octagon: 1 0,0; 2 0,25.4; 3 5.08,0; 4 5.08,25.4; 5 10.16,0; 6 10.16,25.4; 7 15.24,0; 8 15.24,25.4; 9 20.32,0; 10 20.32,25.4; 11 25.4,0; 12 25.4,25.4; 13 30.48,0; 14 30.48,25.4
SOT23-BEC = smd 1 x 1.4: B -0.95,-1.1; C 0,1.1; E 0.95,-1.1
DIOM5226X220N = smd 2.3 x 1.55: 1 -2.15,0; 2 2.15,0
BZV55C5V6L1 = smd 1.25 x 2: 1 -1.875,0; 2 1.875,0

### Placement (x,y rotation side)
13.75V  38.5,1.5 270 top
13.75V_TP  46.5,6 90 top
AUX5V_TP  100.5,2 0 top
AUXBUCK_TP  100.5,14 270 top
C1  53.5,10.5 0 top
C2  46.5,9 0 top
C3  6.5,55.5 0 top
C4  6.5,23.5 180 top
C5  33,59 90 top
C6  33,20 90 top
C7  90.12,8 0 top
C8  85.5,14.12 0 top
C9  87.38,1.75 180 top
C10  100.5,10 90 top
C11  72.5,3.12 90 top
C12  81.5,12.12 0 top
C13  17.38,22 270 top
C14  55,14.5 0 top
C15  146.5,23.5 270 top
C16  166,55.5 90 top
C17  166,23.5 270 top
C18  146.5,55.5 90 top
C19  154.5,32 90 top
C20  76.5,7.88 0 top
C21  72.5,10.5 90 top
C22  43,7.5 90 top
C23  13.88,56.25 270 top
C24  12.75,1.25 0 top
C25  96,8.75 0 top
C26  22.38,2.5 90 top
C27  13,4.5 90 top
C28  25.88,2.5 90 top
C29  24.12,2.5 90 top
C30  6.75,3 90 top
C31  96,10 0 top
C32  20,24 180 top
C33  55,5.5 270 top
C34  100.5,6 270 top
C35  43,65 90 top
C36  57.12,65 0 top
D1  94.5,30 0 top
D2  109,29.5 180 top
D3  109,49.5 0 top
D4  94.5,49 180 top
D5  10,8 180 top
D6  77.5,16.25 0 top
D7  85,16.75 180 top
D8  47,2 180 top
D9  52.5,2 180 top
F1  18.12,43.88 90 top
GATE1_TP  25.5,51.5 0 top
GATE2_TP  26.5,37.5 90 top
HVLED  105.5,13.5 270 top
HVOUT_TP  130,14.5 270 top
IC1  46,12.5 180 top
IC2  16.5,28 0 top
IC3  34.25,6.62 270 top
IC4  84.88,11.62 0 top
IC6  76.5,4 270 top
IC7  10.5,4 270 top
J1  80.62,4.88 270 top
J3  168.5,39.5 270 top
J5  8.5,39.5 90 top
L1  17.5,5.75 0 top
L2  92,14.25 90 top
L3  120.5,39.5 0 top
MAINBUCK_TP  22.62,6.5 180 top
PS1  98,6 90 top
PS2  63.38,7 0 top
PWRGND_TP  130,5 180 top
Q1  34.88,46.38 270 top
Q2  34.88,32.62 270 top
Q5  62.5,16.38 180 top
R1  50.5,7.5 90 top
R2  17,24.5 0 top
R3  21.5,50.5 0 top
R4  21.5,52 0 top
R5  23,27.5 90 top
R6  21.5,27.5 90 top
R7  21.5,35.5 270 top
R8  21.5,43.5 90 top
R9  115,16 90 top
R10  111.5,17.5 180 top
R11  44,16.5 180 top
R12  53.5,12.5 0 top
R13  55,16.5 0 top
R14  106.5,17.5 180 top
R15  72.5,14 270 top
R16  100.5,17.5 0 top
R17  72.5,6.5 90 top
R18  97,17.5 270 top
R19  117.5,2 0 top
R20  32.62,1.75 0 top
R21  29.62,1.75 0 top
R23  77.88,11.25 270 top
R24  42,1.5 180 top
R25  8,3 270 top
R26  10,1.12 180 top
R27  8,5 90 top
R28  87.5,10.88 270 top
R29  81.5,11.12 0 top
R30  82.12,13.62 90 top
R31  75.88,11.25 270 top
R32  91.5,4.5 270 top
R33  52.5,65 0 top
R34  112.5,2 0 top
R35  107.5,2 0 top
R36  106,5.5 270 top
R37  104.5,11 270 top
REG5V  92.5,1.5 90 top
SJ1  86,40 90 bottom
T1  47,22.5 0 top
T1.2  51.5,55 270 top
T2  108,10 90 top
Z3  86.75,4.5 180 top
Z4  113.5,8.5 270 top

### Tracks (layer width: path | path; a pad name or v marks a point on that pad's centre or on a via)
28V
  pour Top (no thermals): 19,43 18.5,43.5 10.5,43.5 10.5,40 19.12,40 19.12,42.88
28VFUSE  (via drill 0.45)
  Top 0.406: IC7.5 10.5,1.5 R26.1
  Top 0.6: C24.1 10.75,1.25 10.5,1.5
  other vias: 33.5,61 34.5,61 35.5,61 36.5,61 41,62.5 35,63 42.5,61 43.5,61 34,60.5 35,60.5 36,60.5 37,60.5 36,64 37,64 38,64 39,64 41,57.5 41,58.5 43,61.5 44,61.5 36,63 44.5,63.5 40,64 41,54.5 44.5,61 41,56.5 41,55.5 41,59.5 41.5,60.5 34,62 35,62 33,59.5 33.5,60 33,60.5 10.5,4 9.5,4 11.5,4 9.5,12.5 11.5,14 11.5,12.5 9.5,14 10,15 44,62.5 43,62.5 42,62.5 39,16 38,15 39,17.5 39,19 39,20.5 33,15 33,20.5 33,19.5 33,18.5 33,17.5 37,15 36,15 34.5,15 34,21.5 35.5,21.5 37,21.5 38.5,21.5 41,64 33,54 33,55 40,54 40.5,55 40.5,57 40.5,59 40.5,58 40.5,56 33.5,54.5 33.5,55.5 16.5,44.5 15.5,44.5 14.5,44.5 13.5,44.5 12.5,44.5 11.5,44.5 18.5,48.5 18.5,49.5 18.5,50.5 18.5,51.5 18.5,52.5 45,40 53.5,42.5 53.5,37 45,44 45,36 11,15 10.5,14 10.5,2.5
  pour Top (rank 2, no thermals): 19,40 7.5,40 7.5,26 -3.5,26 -3.5,40 -4,40 -4,55.5 16.5,55.5 16.5,56.5 31.5,56.5 31.5,59.5 41.5,59.5 41.5,54.13 40.87,53.5 19,53.5
  pour Top (rank 6, no thermals): 42,60.5 44.37,60.5 45,61.13 45,63.87 44.37,64.5 36,64.5 31.5,60 31.5,59.5 41,59.5
  pour Top (rank 3, no thermals): 54,36.13 54,43.87 53.37,44.5 45.13,44.5 44.5,43.87 44.5,36.13 45.13,35.5 53.37,35.5
  pour Bottom (no thermals): 53.5,45 46,45 44.5,46.5 44.5,63.5 44,64 33,64 33,15 44.5,15 44.5,33.5 46,35 53.5,35
  pour Top (rank 2, no thermals): -2,11 34.12,11 39.25,16.13 39.25,20.86 38.62,21.5 33.63,21.5 33,20.86 33,16.5 4,16.5 4,27 -2,27
  pour Top (no thermals): 11.75,4.38 9.38,4.38 9.38,3.12 10,2.5 10,0.5 11,0.5 11,3 11.75,3.75
  pour Bottom (no thermals): 12,15.12 9,15.12 9,2 12,2
  pour Bottom (no thermals): 35.12,56.5 17.5,56.5 11,50 11,44 19.25,44 19.25,53.25 35.12,53.25
AUX1
  Top 0.6: D6.2 79.55,16.95 76,20.5 71,20.5 69.5,22 69.5,52 72.5,55 T1.2.2
  Top 3: T1.2.2 79.4,57.5 T1.16
AUXB  (via drill 0.45)
  Top 0.4: 96.88,8.32 C25.2 | 96.88,9.78 C31.2
  Top 0.55: L2.1 93.08,12.43 93.35,12.15
  Top 0.6: C12.1 80.9,11.22 R29.1 | 93.35,12.15 96,12.15 96.65,11.5 C31.2 97.53,10.88 C10.2 AUXBUCK_TP.TP | PS1.3 96.88,8.32 | C25.2 96.88,9.78
  Top 0.7: C12.1 80.9,12.9 v81,13 | L2.1 90.58,12.43 v90.5,12.5
  Bottom 0.35: v81,13 81,12.6 83.73,9.86 88.86,9.86 90.5,11.5 v90.5,12.5
AUXD
  Top 0.6: R28.1 87.25,11.62 IC4.5
  Top 1: R31.2 R23.2 79.01,9.83 80.24,8.6 85.94,8.6 88.9,5.64 Z3.1
  pour Top (isolate 0.254, rank 3, no thermals): 88,6 88,1 89.5,1 89.5,10 87.5,12 86,12 86,10 86.5,9.5 86.5,7.5
BRIDGEGND
  Top 0.406: R11.2 41.6,16.5 40.5,18.33 40.5,22.5 40.25,22.75 28.25,22.75 26.68,24.32 Q2.3
  pour Top (rank 6, no thermals): 29,34 20,34 20,31 24.5,31 24.5,29 29,29
  pour Top (isolate 0.254, rank 3, no thermals): 29,47.5 20,47.5 20,44 23.62,44 23.62,33 29,33
BS1
  Top 0.406: IC7.1 11.53,5.38 C27.2
BS2
  Top 0.6: IC4.1 83.58,13.07 C8.1
CS-IN
  Top 0.7: R11.1 44.85,16.15 47,14 47,13.5 47.37,13.13 IC1.3 50.63,13.13 52,14.5 C14.1
DC+
  Top 0.6: R9.1 120,14.58 120.5,14.58 121,14.58 | HVOUT_TP.TP 130.58,15.08 130.08,14.58 121,14.58 | 121,14.58 121,13.08 121,4.08 R19.2
  Top 0.8: 133,24 146,24 C15.1
  Top 3: 133,24 133,17.5 HVOUT_TP.TP
  pour Top (isolate 1.422, rank 4, no thermals): 166.5,58 132.5,58 130.5,56 130.5,23 132.5,21 166.5,21
  pour Top (no thermals): 156.5,41 166.62,41 166.62,44 156.5,44
  pour Top (no thermals): 118.5,15 114,15 114,13 119.5,13 119.5,15
  pour Top (no thermals): 121,4 118.5,4 118.5,1 122,1 122,4
DRAIN1
  pour Top (rank 6, no thermals): 53.37,59.5 43.13,59.5 42.5,58.87 42.5,53.13 41.87,52.5 30.64,52.5 30,51.87 30,40.63 30.64,40 42.87,40 43.5,40.63 43.5,46.87 43.63,47 52.87,47 54,48.13 54,58.87
  pour Top (rank 3, no thermals): 52,66 46.5,66 46,65.5 46,56 52,56
DRAIN2
  Top 1.016: 51.6,29.5 T1.2.11
  Top 3: C36.2 58.75,64.88 58.75,31.25 57,29.5 51.6,29.5
  pour Top (rank 3, no thermals): 42.87,39 30.64,39 30,38.37 30,24.64 30.64,24 41.37,24 42,23.36 42,21.14 42.63,20.5 53.37,20.5 54,21.14 54,31.36 51.37,34 43.5,34 43.5,38.37
EN1
  Top 0.406: R26.2 9.5,2.65 IC7.4
EN2
  Top 0.6: IC4.4 86.47,10.38 R28.2
FB1
  Top 0.406: C30.2 6.85,3.5 R25.1 R27.1 8.75,4.5 IC7.3
FB2
  Top 0.6: IC4.3 82.45,10.68 R29.2 82,12.03 C12.2 82.12,12.15 R30.1
GNDA  (via drill 0.45, 3.3 pad 5.5)
  Top 0.4: IC7.2 10.5,6 10,6.5 9.45,6.5 D5.2 | R27.2 v8,7
  Top 0.406: v11.5,27.5 11.63,27.36 IC2.3 12.63,27.36 v11.5,28.5 | R24.1 43.5,2.15 43.5,6 C22.1 43,4.25 v42.88,4.12 | 47.5,9.12 C2.2 47.75,9 | 55,11 54.88,11 C1.2
  Top 0.6: C24.2 13.87,1 21.88,1 C26.1 | 56,7.38 v56,9.5 | PS2.1 59.56,5.94 58.5,7 57.88,6.38 C33.1
  Top 0.7: 44.09,14.4 v45,13.5 | IC1.5 44.09,14.4 | 44.09,14.4 v45.5,13 | 47.5,9.12 v48.38,9.12 | 47.75,9 v48.38,8.38
  other vias: 11,39 12,39 14,39 15,39 9,39 10,39 9,33 13,39 9,38 9,37 18,37 18,36 18,35 18,34 18,33 17,37 17,36 17,35 17,34 17,33 5,20.5 5,17.5 5,18.5 8,20.5 8,18.5 8,17.5 6,22 8,21.5 21,1.5 20,1.5 27.25,1.12 27.25,2.12 30.5,18.5 29.5,18.5 28.5,18.5 27.5,18.5 26.5,18.5 26.5,21.5 27.5,21.5 28.5,21.5 29.5,21.5 30.5,21.5 56,11.5 56,10.5 59.5,17 59,19 58,19 57,19 56,19 53.5,18.5 52.5,18.5 53,19 52,19 54,19 30.5,60.5 29.5,60.5 28.5,60.5 27.5,60.5 26.5,60.5 26.5,57.5 27.5,57.5 28.5,57.5 29.5,57.5 30.5,57.5 45.5,68 45.5,69 45.5,70 48.5,70 48.5,69 48.5,68 5,58 5,59 5,60 5,62 8,62 8,61 8,60 8,59 8,58 5,61 8,19.5 7,22 5,19.5 5,21.5 3,3 3,70.5 6,5.5 23.5,24 22.5,24 23,23.5 22.5,23 23.5,23 18.5,21.5 19.5,21.5 19,21 20,21 13,21 12,22 16,18 14,20 15,19 12,31.5 13,31.5 18,31.5 14,31.5 15,31.5 16,31.5 17,31.5 19,31.5 15,18 14,18 13,18 12,18 11,18 10,18 9,18 22.5,39.5 21.5,39.5 12,56.5 11,56.5 15.5,56.5 51,69 41.5,65 44.5,65.5 41.5,66.5 44.5,67 31.5,61 59.5,18 59.5,13.5 59,8 59,10 59,9 56,12.5 56,13.5 59,7 58,7 57,7 46,13.5 45,12.5 46,12.5 45.5,14 8,8 8,9 7,8.5 7,7.5
  pour Bottom (rank 6): 60.12,80 60.12,-3 -20,-3 -20,80
  pour Top (isolate 0.254, rank 6, no thermals): 19.5,39 8.5,39 8.5,25 5,25 5,17.5 29.86,17.5 30.5,18.13 30.5,21.5 12,21.5 12,31.5 19,31.5 19,35 22.75,35 22.75,43 19.5,43
  pour Top (rank 6, no thermals): 30.5,73.5 -3.5,73.5 -3.5,56.5 15.5,56.5 15.5,57.5 30.5,57.5
  pour Top (rank 6, no thermals): 23.36,25 21.14,25 20.5,24.36 20.5,21.14 24,21.14 24,24.36
  pour Top (rank 3, no thermals): 28.5,58 35.5,65 45,65 45,66 46,67 52,67 52,73.5 28.5,73.5
  pour Top (rank 6, no thermals): 59.87,9.5 59.87,19.5 49.63,19.5 49,18.87 49,15.5 50.5,15.5 51,16 53,16 54,17 55,17 55,14 54.5,13.5 54,13.5 53.5,13 53.5,11.5 54,11 54,10 54.5,9.5
  pour Top (rank 6, no thermals): 9,11 -3.5,11 -3.5,4 0.5,0 4.5,0 6,1.5 6,5.5 7,6.5 8,6.5 9,7.5
  pour Top (no thermals): 7,6 9.5,6 10,5.5 10,5 10.75,5 10.75,6.25 10,7 10,9 9,10 7.5,10 6.5,9 6.5,6.5
  pour Top (rank 6, no thermals): 28,3 27.5,2.5 21.5,2.5 21,2 19,2 18.5,1.5 18.5,0 29.38,0 29.38,3
  pour Top (rank 6, no thermals): 59.99,6 59.99,19.5 49.63,19.5 49,18.87 49,15.5 50.5,15.5 51,16 53,16 54,17 55,17 55,14 54.5,13.5 54,13.5 53.5,13 53.5,11.5 54,11 54,6
  pour Top (no thermals): 46,15 43,15 42.5,14.5 42.5,14 44,14 44.5,13.5 44.5,12 46,12 46.5,12.5 46.5,13.5 46.5,14.5
  pour Top (no thermals): 43.5,6.5 42.5,6.5 42.5,0.5 43.5,0.5
LEDIND
  Top 0.6: Z4.2 109.58,6.62 107.5,4.55 R36.2 106,2.08 R35.1
N$1
  Top 0.7: R9.2 114.92,17.5
  Top 1: 114.92,17.5 R10.1
  pour Top (no thermals): 118.5,18.5 112.5,18.5 112.5,16.5 118.5,16.5
N$2  (via drill 0.45)
  Top 0.3: 41.87,11.87 v41.5,11.5 | v14.5,22.5 15,23 15,28.64 IC2.2
  Top 0.406: IC1.7 41.87,11.87
  Bottom 0.3: v14.5,22.5 13.75,23.25 12.84,23.25 12.84,22.28 21.53,13.59 26.41,13.59 30.88,9.12 39.12,9.12 v41.5,11.5
N$3  (via drill 0.45)
  Top 0.35: C20.1 74.62,7.88 72.88,9.62 C21.1
  Top 0.4: 75.55,7.8 C20.1 | R16.2 101.45,16 100,16 99,15 v96.5,15
  Top 0.7: 75.55,7.8 IC6.2 75.55,6.55 75.62,6.62 v75.88,6.38 | R14.2 R16.2
  Bottom 0.35: 80.61,6.14 80.38,6.38 v75.88,6.38 | v96.5,15 96.5,12 89.5,5 82.28,5 81.12,6.14 J1.1
  Bottom 0.4: J1.1 80.61,6.14
N$4
  Top 0.6: D8.1 D9.2
N$5  (via drill 0.45)
  Top 0.3: IC1.6 42.13,13.13 v41.5,12.5 | v13.5,22.5 13.5,25.8 IC2.4
  Bottom 0.3: v13.5,22.5 21.88,14.12 26.62,14.12 31,9.75 38.75,9.75 v41.5,12.5
N$6
  Top 0.305: R2.1 16.5,29.91
  Top 0.406: IC2.8 16.5,29.91 IC2.1
N$7  (via drill 0.45)
  Top 0.813: R4.1 R3.1 20.55,49 | 20.55,49 v20,49 | v21,49 20.55,49 | v20,28.62 19.21,28.62 IC2.7
  Bottom 0.813: v20,49 21,48 24,48 24,35.5 20,31.5 20,30.5 v20,28.62
N$8
  Top 0.61: IC2.5 21.5,26.09 | 21.5,26.09 R6.1 | R5.1 23,26.09 21.5,26.09
N$9
  Bottom 0.8: T1.11 83.5,32.5 86,35 SJ1.1
N$10
  Top 0.4: IC3.1 29.95,8.41 31.4,8.41 31.4,2.12 R20.1 R21.2
N$11
  Top 0.6: D9.1 55,2.8 C33.2 55,3.5 58,0.5 61,0.5 62.1,1.61 PS2.3
N$13
  Top 0.406: IC1.2 52.02,11.87 R12.1
N$15
  Top 1: R10.2 R14.1
  pour Top (no thermals): 110.5,19 107.5,19 107.5,16.5 110.5,16.5
N$16
  Top 0.4: R16.1 99.46,17.11 98.76,16.55 R18.2
N$18  (via drill 0.45)
  Top 0.35: Q5.2 69.7,17.64 R15.1 | v71,14 71,15 68.36,17.64
  Top 0.4: 77.45,7.8 C20.2 | 68.36,17.64 Q5.2
  Top 0.7: IC6.1 77.45,7.8 | v78.5,8 78.38,7.88 C20.2
  Bottom 0.4: v78.5,8 74.5,8 71,11.5 v71,14
N$19
  Top 0.35: Q5.1 69.2,13.11 69.2,10.3 72.15,7.35 R17.2
N$20
  Top 1: R35.2 R34.1
  pour Top (no thermals): 111.5,3.5 109,3.5 108.5,3 108.5,1 111.5,1
N$21
  Top 0.5: R15.2 C21.2
N$22
  Top 0.406: 13.75V.C R24.2
N$23
  Top 1: R34.2 R19.1
  pour Top (no thermals): 116.5,3.5 113.5,3.5 113.5,1 116.5,1
N$24
  Top 0.6: Z4.1 112.17,9.05 T2.B
N$25
  Bottom 0.8: SJ1.3 85.96,42.5 T1.13
N$26
  Top 0.8: R32.2 91.5,3.27 91.4,3.25 91.4,1.55 REG5V.C
N$27
  Top 1: R23.1 R31.1 75.88,15.82 D6.1
N$29
  Top 1.5: R33.2 C36.1
N$31
  Top 0.4: 106.55,10.35 T2.C
  Top 0.6: HVLED.C 106.55,10.35
N$32
  Top 0.4: 104.45,11.9 HVLED.A
  Top 0.55: R37.1 104.45,11.9
OPTO-EMITT  (via drill 0.45)
  Top 0.7: IC1.1 49.91,10.59 50.5,10 v50.5,9.5 R1.2 | Q5.4 57.8,9 57.5,9 v57,8.5
  Bottom 0.406: v57,8.5 51.5,8.5 v50.5,9.5
PRE  (via drill 0.45)
  Top 0.4: R25.2 v8,1.5 | v19.5,3 19.32,3.17 L1.2
  Top 0.406: R25.2 7.9,2.4 C30.1
  Bottom 0.4: v8,1.5 8.5,1 18.5,1 19.5,2 v19.5,3
  pour Top (no thermals): 21.5,3 30.11,3 30.75,3.63 30.75,6.87 30.11,7.5 24.5,7.5 23.5,8.5 19.14,8.5 18.5,7.87 18.5,3 19,2.5 21,2.5
PWRGND  (via drill 0.45)
  Top 0.55: C11.1 72.62,2.12 74.38,2.12 v74.5,2.25 74.5,2.12 75.67,2.12 IC6.3 77.5,1.95 81.5,1.95 81.5,2.73 J1.2 | 67.36,2.12 70.38,2.12 71.5,2.12 72.38,2.12
  Top 0.6: IC4.2 84.62,11.62 v85,12 | PS2.7 67.36,2.12 | 72.38,2.12 C11.1
  Top 0.7: v85,11 v85,12 v85,13
  Top 0.8: C15.2 146.5,12.5 139,5
  Top 3: T1.2.4 79.42,49.92 T1.15 | PWRGND_TP.TP 139,5
  other vias: 84,15.5 83,17 84,17 82,17 85.25,6.88 93,10.12 92,10.12 93.5,4.12 93.5,7.62 95.5,7.12 102,7.12 95.5,4.12 102,9.12 106.5,7.62 111,11.62 110,11.62 83,6.62 85,2.12 84.5,6.62 83,15.5 82,15.5 83.75,6.88 93.5,23.12 94.5,23.12 95.5,23.12 95,24.12 94,24.12 94,22.12 95,22.12 90.5,22.12 90.5,23.12 90.5,24.12 98.5,24.12 98.5,23.12 98.5,22.12 95.5,21.12 93.5,21.12 94.5,21.12 91.5,20.62 92.5,20.62 96.5,20.62 97.5,20.62 93.5,55.62 94.5,55.62 95.5,55.62 95,56.62 94,56.62 94,54.62 95,54.62 90.5,54.62 90.5,55.62 90.5,56.62 98.5,56.62 98.5,55.62 98.5,54.62 91.5,58.12 92.5,58.12 96.5,58.12 97.5,58.12 93.5,57.62 95.5,57.62 90.5,57.62 98.5,57.62 94,58.62 90,58.62 88,58.62 89,58.62 95,58.62 98.5,58.62 94.5,57.62 87,58.12 88,54.12 87,53.12 86,52.12 86,57.12 85,56.12 84,55.12 79,51.12 75,48.12 75,51.12 79,48.12 84,50.12 85,51.12 85.5,61.12 85.5,62.62 85.5,64.12 85.5,66.12 85.5,68.12 85.5,70.12 87,71.12 144.5,60.62 146.5,60.62 148.5,60.62 164,60.62 166,60.62 168,60.62 162.5,37 163.5,37 164.5,37 165.5,37 166.5,37 161.5,37 162,36 162,38 163,38 164,38 165,38 165,36 164,36 163,36 166,38 166,36 144.5,18.5 146.5,18.5 148.5,18.5 164,18.5 166,18.5 168,18.5 137.5,10 137.5,8.5 137.5,7 90.5,20.62 98.5,20.62 105.5,7.62 84,2.12 84.5,2.62 102,8.12 91,9.62 92.5,6.62
  pour Bottom (isolate 1.016, rank 6, no thermals): 185,75.5 67,75.5 67,5 76.5,-4.5 182,-4.5 186,-0.5 186,74.5
  pour Top (isolate 0.406, rank 5, no thermals): 86,7.5 82,7.5 82,7 81.5,6.5 80,6.5 79.5,6 79.5,1 87,1 87,6.5
  pour Top (no thermals): 95.5,10.5 91,10.5 90.62,10.12 90.62,5.38 92.5,3.5 97.5,3.5 98,4 98,5.5 97.5,6 97,6 95.5,7.5
  pour Top (no thermals): 111.25,12.25 108.75,12.25 108.5,12 108.5,10.5 111.25,10.5
  pour Top (no thermals): 99,59 87.5,59 82.5,54 81.5,54 79.5,52 75.5,52 74.5,51 74.5,48.5 75.5,47.5 81.5,47.5 88.5,54.5 99,54.5
  pour Top (no thermals): 98,20 98.86,20 98.86,25 90.14,25 90.14,20 93,20 94.5,18.5 98,18.5
  pour Bottom (isolate 0.254, no thermals): 101.5,17.5 67,17.5 67,1 68.5,1 103,1 103,16
  pour Top (isolate 1.778, no thermals): 168.5,38 158,38 153,33 153,30.5 156.5,30.5 162,36 168.5,36
  pour Top (isolate 1.778, no thermals): 167.5,19 137,19 137,2 180.5,2 180.5,81 87.5,81 85,78.5 85,55.5 86,54.5 99,54.5 99,59 100.5,60.5 167.5,60.5 169,59 169,40.5 166.5,38 166,38 166,36 169,33 169,20.5
  pour Top (no thermals): 170,38.38 158,38.38 158,36 170,36
  pour Bottom (no thermals): 169.5,38.5 158,38.5 158,36 169.5,36
  pour Top (no thermals): 81.5,14 83,14 85,16 85,17.5 81.5,17.5
  pour Top (no thermals): 105.25,8.25 105.25,6 107,6 107,8.25
  pour Top (no thermals): 102.5,9.5 100,9.5 100,6.5 102.5,6.5
Q1G
  Top 0.61: R3.2 22.45,51.5 | 22.45,51.5 GATE1_TP.TP 25.5,48.91 Q1.1 | R4.2 22.45,51.5
  Top 0.813: R4.2 R3.2
Q2G  (via drill 0.45)
  Top 0.61: v23,30 R5.2 R6.2 v21.5,30
  Top 1.016: Q2.1 26.68,37.32 GATE2_TP.TP
  Bottom 1.016: v21.5,30 v23,30 23,32.5 26.5,36 GATE2_TP.TP
RECT  (via drill 0.45)
  other vias: 110,25 110,23.5 108.5,23.5 108.5,25 105.5,29.5 105.5,26.5 105.5,28 107,26.5 108.5,26.5 108.5,28 108.5,29.5 107,28 107,29.5 110,29.5 110,26.5 110,28 111.5,26.5 111.5,28 111.5,29.5 105.5,23.5 105.5,25 103.5,28 103.5,26.5 103.5,25 104.5,30.5 106,30.5 107.5,30.5 109,30.5 110.5,30.5 112,30.5 113.5,30.5 113,29.5 114.5,29.5 114.5,28 114.5,26.5 114.5,25 114.5,23.5 114.5,22 113,22 111.5,22 110,22 108.5,22 107,22 105.5,22 104,22 113,28 113,25 111.5,25 111.5,23.5 113,23.5 107,23.5 107,25 103.5,23.5 103.5,29.5 113,26.5 108,54 108,55.5 109.5,55.5 109.5,54 112.5,49.5 112.5,52.5 112.5,51 111,52.5 109.5,52.5 109.5,51 109.5,49.5 111,51 111,49.5 108,49.5 108,52.5 108,51 106.5,52.5 106.5,51 106.5,49.5 112.5,55.5 112.5,54 114.5,51 114.5,52.5 114.5,54 113.5,48.5 112,48.5 110.5,48.5 109,48.5 107.5,48.5 106,48.5 104.5,48.5 105,49.5 103.5,49.5 103.5,51 103.5,52.5 103.5,54 103.5,55.5 103.5,57 105,57 106.5,57 108,57 109.5,57 111,57 112.5,57 114,57 105,51 105,54 106.5,54 106.5,55.5 105,55.5 111,55.5 111,54 114.5,55.5 114.5,49.5 105,52.5 122.5,40.5 122.5,38.5 118.5,40.5 118.5,38.5 119.5,41.5 121.5,41.5 121.5,37.5 119.5,37.5
  pour Bottom (isolate 1.27, no thermals): 125,57.25 103.38,57.25 103.38,48.5 115,48.5 118,45.5 118,33.5 114,29.5 114,21.75 125,21.75
  pour Bottom (isolate 1.27, no thermals): 103.38,21.75 114.62,21.75 114.62,30.5 103.38,30.5
  pour Top (no thermals): 105.5,30.5 115,30.5 118,33.5 118,45.5 115,48.5 103.5,48.5 103.5,56.5 104.25,57.25 125,57.25 125,21.75 107.75,21.75 105.5,24
REG  (via drill 0.45)
  Top 0.3: IC3.4 34.5,8.75 v36.5,10.75 | C32.2 17.5,24 v17,23.5
  Top 0.4: R20.2 37.2,1.75 13.75V.A 37.45,5.8 IC3.4
  Top 0.6: D8.2 45.3,4.8 13.75V_TP.TP
  Top 1: v17,23.5 16.5,23 v16,23.5 | v16,23.5 v16,22.5 | v16,23.5 16.62,22.88
  Top 1.2: 16.62,22.88 C13.1
  Bottom 1: v36.5,10.75 35.75,10.75 v35.25,10.75
  Bottom 1.2: v37.75,10.75 v36.5,10.75 31.6,10.75 27.3,15.05 22.45,15.05 16,21.5 v16,23.5 17,22.5 v17,23.5
  pour Top (rank 6, no thermals): 20,28 17,28 17,24 16.88,23.88 16,23.88 15.75,23.62 15.75,22.5 19.5,22.5 19.5,25.5 18.5,25.5 18.5,26.5 20,26.5
  pour Top (rank 3, no thermals): 45.87,11 31.5,11 31.5,4 42,4 42,8.5 44.5,8.5 44.5,3.5 53.5,3.5 53.5,11 52,11 51.5,10.5 51.5,8 51,7.5 47,7.5 46.5,8 46.5,10.37
  pour Bottom: 16.75,23.75 16,23.75 16,21.5 17.12,21.5 17.25,21.62 17.25,23.25
REG5V  (via drill 0.45)
  Top 0.4: AUX5V_TP.TP 104.5,6 R37.2
  Top 0.406: 72.5,6 72.5,5.5 C11.2 R17.1 72.5,6
  Top 0.5: C11.2 73.5,5 v74,5
  Top 0.55: AUX5V_TP.TP 100.38,2 C34.2
  Top 0.6: REG5V.A 93.62,1.58 v93.62,2.75 97,2.75 97.75,2.75 98.95,3.95 PS1.2 99.28,5.12 C34.2 | R17.1 70.85,5.65 67.19,9.32 PS2.8
  Bottom 0.55: v93.62,2.75 91.38,0.5 73.5,0.5 72.5,1.5 72.5,3.5 v74,5
RT
  Top 0.406: IC1.4 50.41,14.4 52,16 53.65,16 R13.1
SWITCH1
  pour Top (rank 3, no thermals): 17,0.5 17.31,0.81 17.5,1.26 17.5,8.87 16.86,9.5 10.38,9.5 10.38,6.5 13.5,6.5 14,6 14,4.5 12.75,3.25 11.25,3.25 11.25,1.75 12.5,0.5
SWITCH2
  pour Top (isolate 0.305, rank 2, no thermals): 86,12.5 86.5,12.5 87,13 88.5,13 89.5,14 94,14 94,17.5 86,17.5
TRANS1  (via drill 0.45)
  Bottom 0.4: SJ1.2 85.5,39.5 77.16,39.5 T1.2.8
  Bottom 1: SJ1.2 87.5,40 89,41.5 v89.5,41.5
  other vias: 95.5,44.5 95.5,43 94,43 94,44.5 91,49 91,46 91,47.5 92.5,46 94,46 94,47.5 94,49 92.5,47.5 92.5,49 95.5,49 95.5,46 95.5,47.5 97,46 97,47.5 97,49 91,43 91,44.5 89,47.5 89,46 89,44.5 90,50 91.5,50 93,50 94.5,50 96,50 97.5,50 99,50 98.5,49 100,49 100,47.5 100,46 100,44.5 100,43 100,41.5 98.5,41.5 97,41.5 95.5,41.5 94,41.5 92.5,41.5 91,41.5 98.5,47.5 98.5,44.5 97,44.5 97,43 98.5,43 92.5,43 92.5,44.5 89,43 89,49 98.5,46 106.5,43.5 106.5,42.5 106.5,41.5 111.5,41.5 111.5,42.5 111.5,43.5 113.5,43.5 113.5,42.5 113.5,41.5 103.5,44 110,44 103.5,41 108,44 108,41 109,41 110,41 109,44 104.5,44 104.5,41
  pour Top (isolate 1.27, no thermals): 114,44 102.88,44 100.5,46.38 100.5,50.5 89,50.5 88.5,50 88.5,41 114,41
  pour Bottom (isolate 1.27, no thermals): 100.5,50.5 89,50.5 88.5,50 88.5,41.12 113.88,41.12 113.88,43.88 102.89,43.88 100.5,46.27
TRANS2  (via drill 0.45)
  Top 3: T1.2.14 78.92,22.5 T1.9
  other vias: 93.5,34.5 93.5,36 95,36 95,34.5 98,30 98,33 98,31.5 96.5,33 95,33 95,31.5 95,30 96.5,31.5 96.5,30 93.5,30 93.5,33 93.5,31.5 92,33 92,31.5 92,30 98,36 98,34.5 100,31.5 100,33 100,34.5 99,29 97.5,29 96,29 94.5,29 93,29 91.5,29 90,29 90.5,30 89,30 89,31.5 89,33 89,34.5 89,36 89,37.5 90.5,37.5 92,37.5 93.5,37.5 95,37.5 96.5,37.5 98,37.5 99.5,37.5 90.5,31.5 90.5,34.5 92,34.5 92,36 90.5,36 96.5,36 96.5,34.5 100,36 100,30 90.5,33 106.5,37.5 106.5,36.5 106.5,35.5 111.5,37.5 111.5,36.5 111.5,35.5 108,38 109,38 110,38 110,34.5 109,34.5 108,34.5 113.5,35.5 113.5,36.5 113.5,37.5 104.5,34.5 104.5,38 103.5,38 103.5,34.5
  pour Top (isolate 1.27, no thermals): 114,38 87,38 87,29 82.5,24.5 79.5,24.5 77.5,26.5 76.5,26.5 75.5,25.5 75.5,23.5 78,21 83,21 90,28 100.5,28 100.5,31.5 103.5,34.5 114,34.5
  pour Bottom (isolate 1.27, no thermals): 114,38 88.5,38 88.5,28 100.5,28 100.5,31.49 103.51,34.5 114,34.5

### Text on the board
Document: empty space! yay! | HV WARN